# EAGLE design board (EAGLE 6.4)
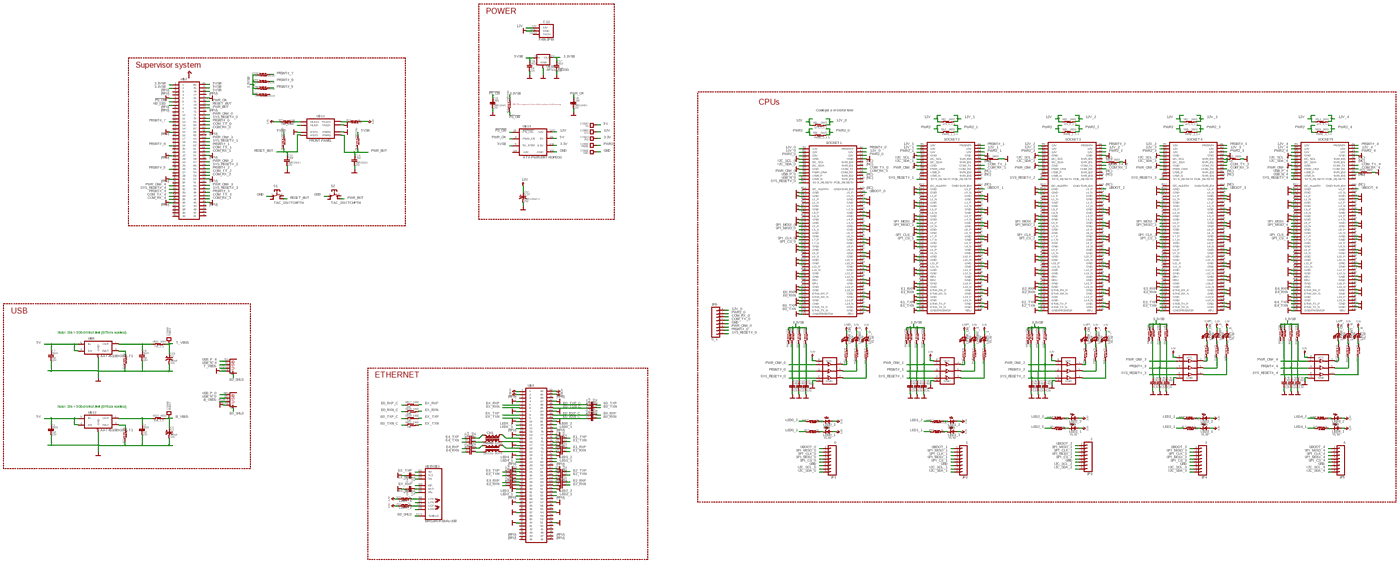
[diagram p0: schematic, sheet 1, overview]
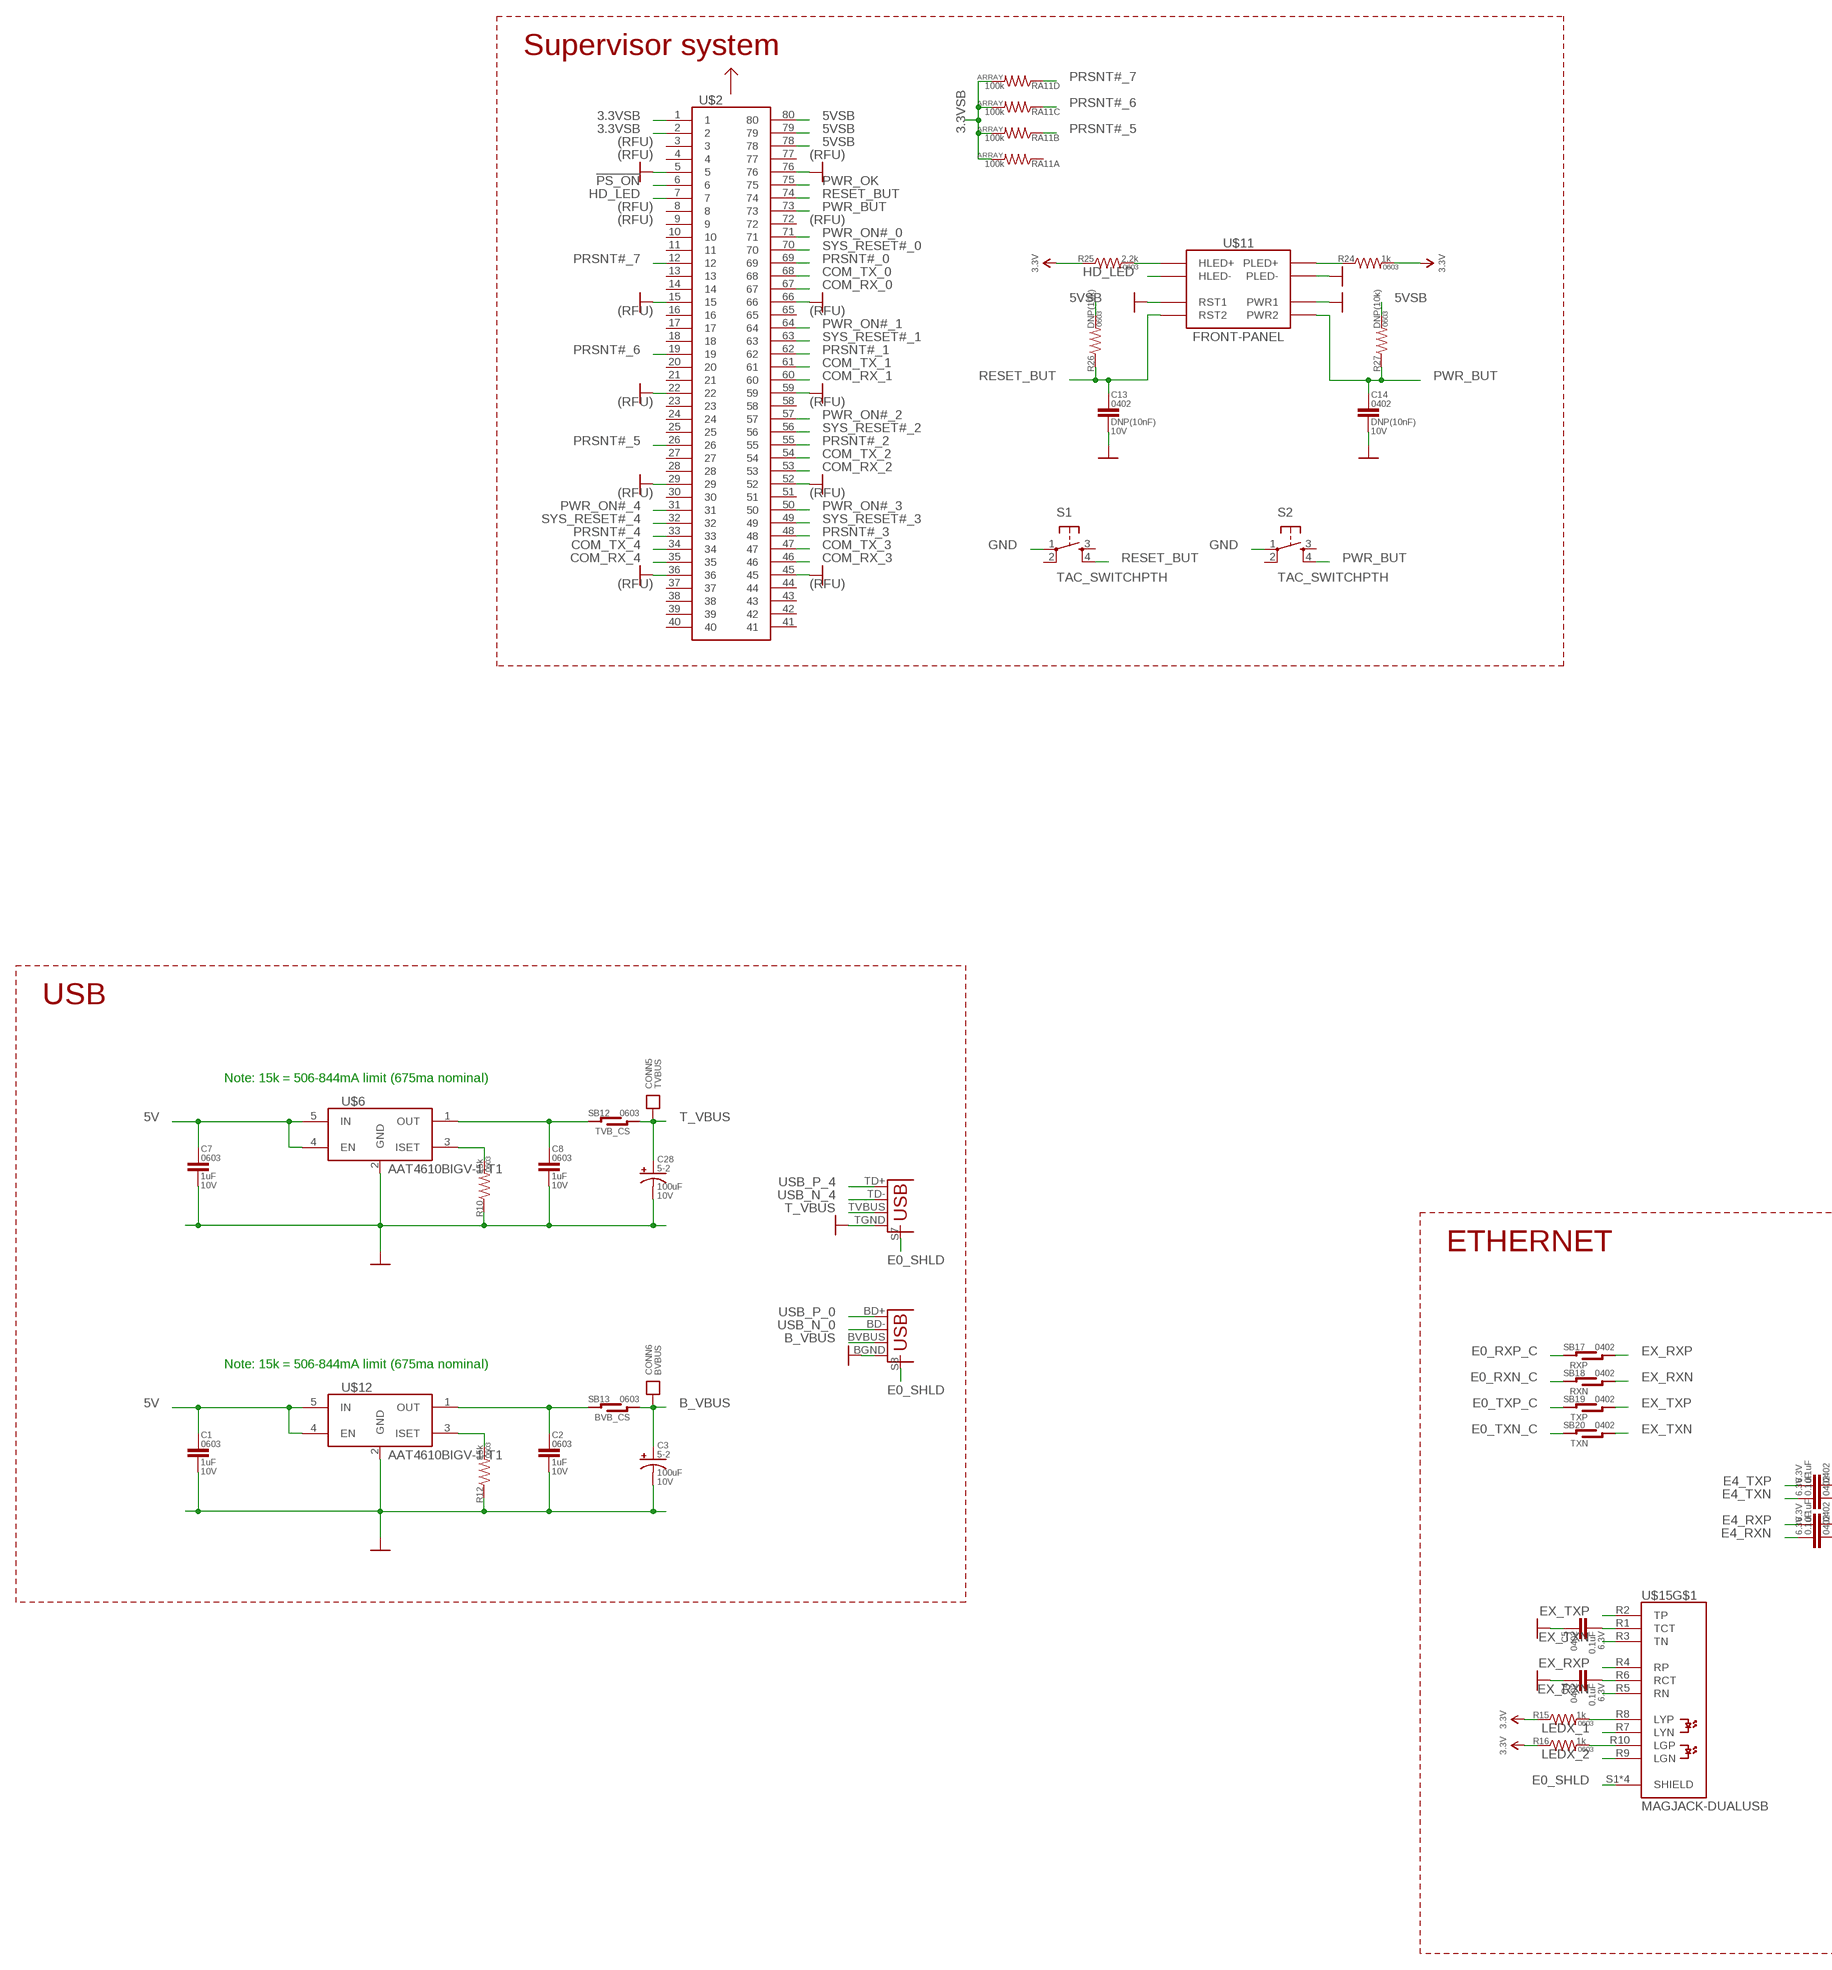
[diagram p1: schematic, sheet 1, part 1 of 4]
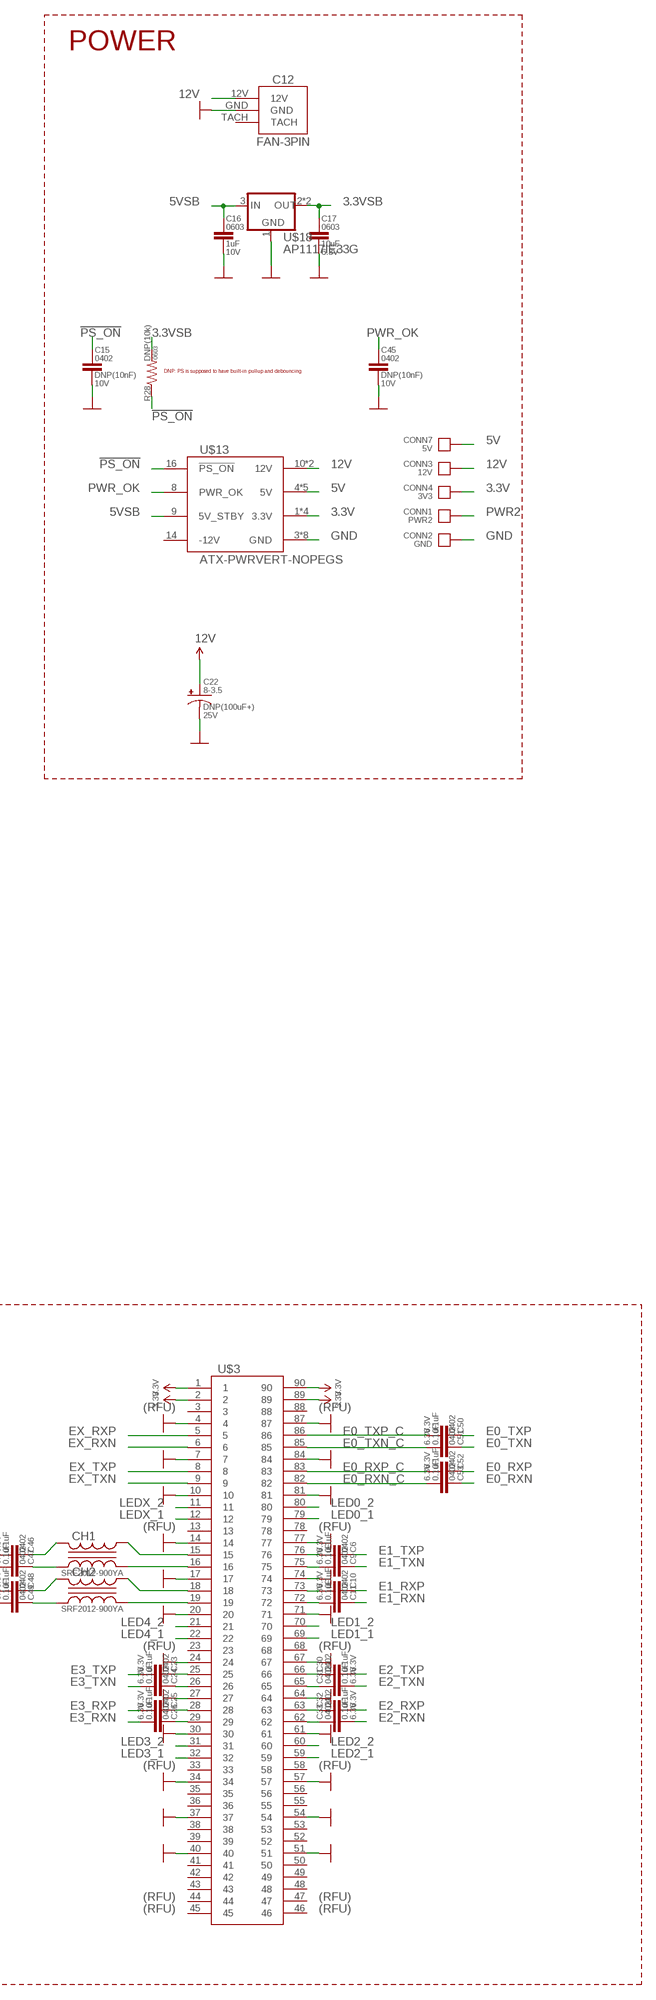
[diagram p2: schematic, sheet 1, part 2 of 4]
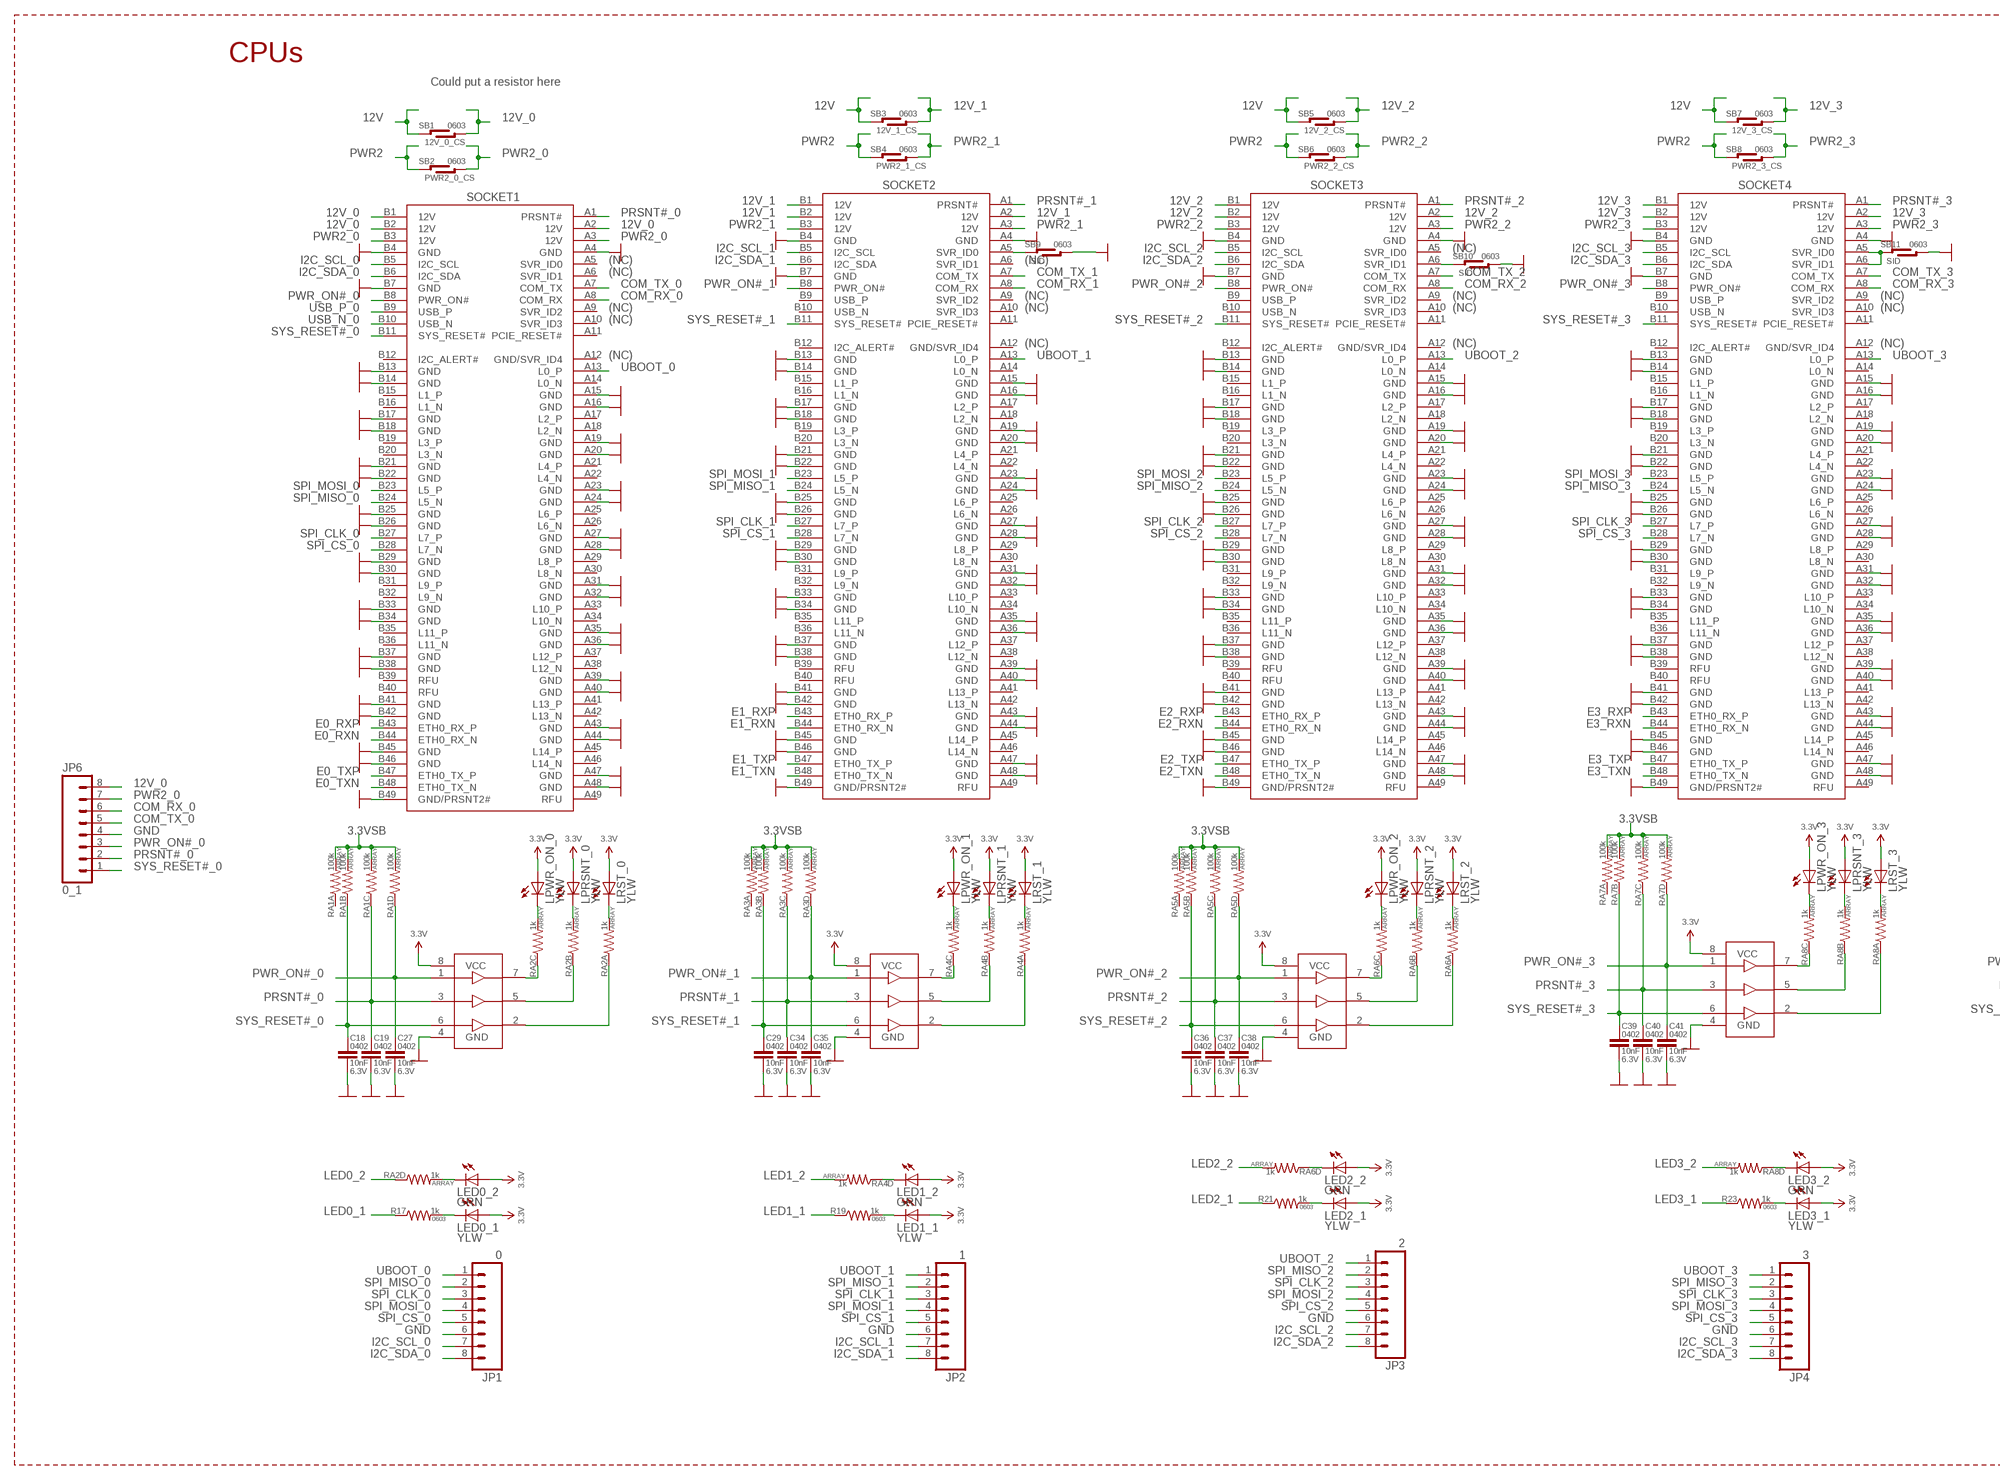
[diagram p3: schematic, sheet 1, part 3 of 4]
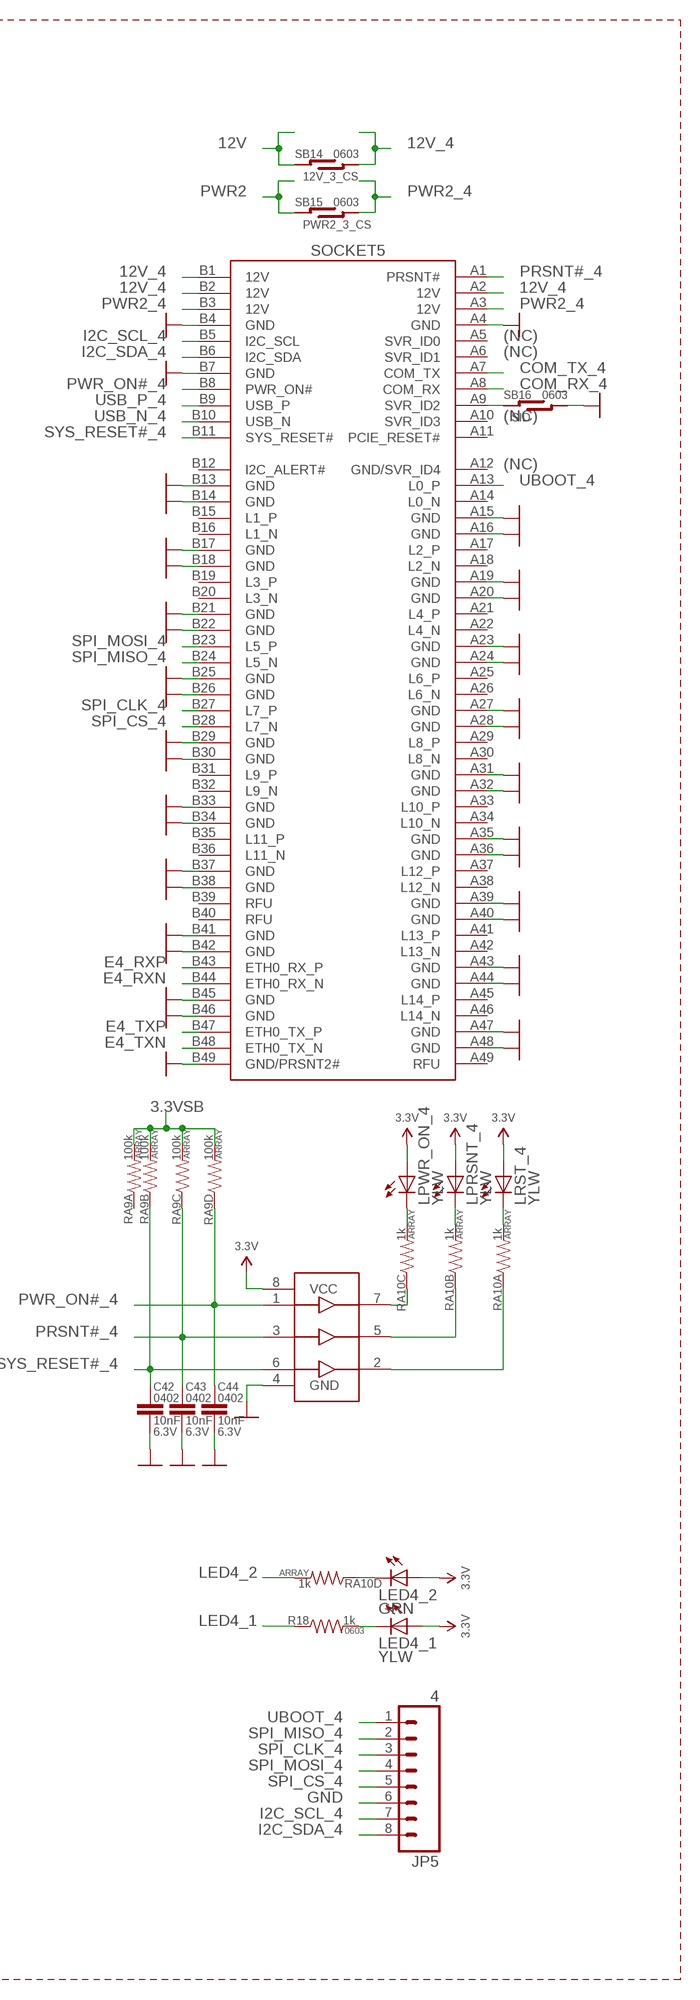
[diagram p4: schematic, sheet 1, part 4 of 4]

## Parts
C1  1uF  CAP0603  [0603-CAP]
C2  1uF  CAP0603  [0603-CAP]
C3  100uF  CAP_POLPTH-5-2  [CAP-5-2]
C4  0.1uF  CAP0402-CAP  [0402-CAP]
C5  0.1uF  CAP0402-CAP  [0402-CAP]
C6  0.1uF  CAP0402-CAP  [0402-CAP]
C7  1uF  CAP0603  [0603-CAP]
C8  1uF  CAP0603  [0603-CAP]
C9  0.1uF  CAP0402-CAP  [0402-CAP]
C10  0.1uF  CAP0402-CAP  [0402-CAP]
C11  0.1uF  CAP0402-CAP  [0402-CAP]
C12  FAN-3PIN  [FAN-3PIN]
C13  DNP(10nF)  CAP0402-CAP  [0402-CAP]
C14  DNP(10nF)  CAP0402-CAP  [0402-CAP]
C15  DNP(10nF)  CAP0402-CAP  [0402-CAP]
C16  1uF  CAP0603  [0603-CAP]
C17  10uF  CAP0603  [0603-CAP]
C18  10nF  CAP0402-CAP  [0402-CAP]
C19  10nF  CAP0402-CAP  [0402-CAP]
C22  DNP(100uF+)  CAP_POLPTH-8-3.5  [CAP-8-3.5]
C23  0.1uF  CAP0402-CAP  [0402-CAP]
C24  0.1uF  CAP0402-CAP  [0402-CAP]
C25  0.1uF  CAP0402-CAP  [0402-CAP]
C26  0.1uF  CAP0402-CAP  [0402-CAP]
C27  10nF  CAP0402-CAP  [0402-CAP]
C28  100uF  CAP_POLPTH-5-2  [CAP-5-2]
C29  10nF  CAP0402-CAP  [0402-CAP]
C30  0.1uF  CAP0402-CAP  [0402-CAP]
C31  0.1uF  CAP0402-CAP  [0402-CAP]
C32  0.1uF  CAP0402-CAP  [0402-CAP]
C33  0.1uF  CAP0402-CAP  [0402-CAP]
C34  10nF  CAP0402-CAP  [0402-CAP]
C35  10nF  CAP0402-CAP  [0402-CAP]
C36  10nF  CAP0402-CAP  [0402-CAP]
C37  10nF  CAP0402-CAP  [0402-CAP]
C38  10nF  CAP0402-CAP  [0402-CAP]
C39  10nF  CAP0402-CAP  [0402-CAP]
C40  10nF  CAP0402-CAP  [0402-CAP]
C41  10nF  CAP0402-CAP  [0402-CAP]
C42  10nF  CAP0402-CAP  [0402-CAP]
C43  10nF  CAP0402-CAP  [0402-CAP]
C44  10nF  CAP0402-CAP  [0402-CAP]
C45  DNP(10nF)  CAP0402-CAP  [0402-CAP]
C46  0.1uF  CAP0402-CAP  [0402-CAP]
C47  0.1uF  CAP0402-CAP  [0402-CAP]
C48  0.1uF  CAP0402-CAP  [0402-CAP]
C49  0.1uF  CAP0402-CAP  [0402-CAP]
C50  0.1uF  CAP0402-CAP  [0402-CAP]
C51  0.1uF  CAP0402-CAP  [0402-CAP]
C52  0.1uF  CAP0402-CAP  [0402-CAP]
C53  0.1uF  CAP0402-CAP  [0402-CAP]
CH1  SRF2012-900YA  COMMON_MODE_CHOKE  [SRF2012A]
CH2  SRF2012-900YA  COMMON_MODE_CHOKE  [SRF2012A]
CONN1  PWR2  CONNECTOR18AWG  [HOLE_18AWG]
CONN2  GND  CONNECTOR18AWG  [HOLE_18AWG]
CONN3  12V  CONNECTOR18AWG  [HOLE_18AWG]
CONN4  3V3  CONNECTOR18AWG  [HOLE_18AWG]
CONN5  TVBUS  CONNECTOR22AWG  [HOLE_22AWG]
CONN6  BVBUS  CONNECTOR22AWG  [HOLE_22AWG]
CONN7  5V  CONNECTOR18AWG  [HOLE_18AWG]
IC1  74X3G34  [TSSOP8]
IC2  74X3G34  [TSSOP8]
IC3  74X3G34  [TSSOP8]
IC4  74X3G34  [TSSOP8]
IC5  74X3G34  [TSSOP8]
JP1  0  M081X08  [1X08]
JP2  1  M081X08  [1X08]
JP3  2  M081X08  [1X08]
JP4  3  M081X08  [1X08]
JP5  4  M081X08  [1X08]
JP6  0_1  M081X08  [1X08]
LED0_1  YLW  LED0603  [0603_LED]
LED0_2  GRN  LED0603  [0603_LED]
LED1_1  YLW  LED0603  [0603_LED]
LED1_2  GRN  LED0603  [0603_LED]
LED2_1  YLW  LED0603  [0603_LED]
LED2_2  GRN  LED0603  [0603_LED]
LED3_1  YLW  LED0603  [0603_LED]
LED3_2  GRN  LED0603  [0603_LED]
LED4_1  YLW  LED0603  [0603_LED]
LED4_2  GRN  LED0603  [0603_LED]
LPRSNT_0  YLW  LED0603  [0603_LED]
LPRSNT_1  YLW  LED0603  [0603_LED]
LPRSNT_2  YLW  LED0603  [0603_LED]
LPRSNT_3  YLW  LED0603  [0603_LED]
LPRSNT_4  YLW  LED0603  [0603_LED]
LPWR_ON_0  YLW  LED0603  [0603_LED]
LPWR_ON_1  YLW  LED0603  [0603_LED]
LPWR_ON_2  YLW  LED0603  [0603_LED]
LPWR_ON_3  YLW  LED0603  [0603_LED]
LPWR_ON_4  YLW  LED0603  [0603_LED]
LRST_0  YLW  LED0603  [0603_LED]
LRST_1  YLW  LED0603  [0603_LED]
LRST_2  YLW  LED0603  [0603_LED]
LRST_3  YLW  LED0603  [0603_LED]
LRST_4  YLW  LED0603  [0603_LED]
R10  15k  RESISTOR0603  [0603-RES]
R12  15k  RESISTOR0603  [0603-RES]
R15  1k  RESISTOR0603  [0603-RES]
R16  1k  RESISTOR0603  [0603-RES]
R17  1k  RESISTOR0603  [0603-RES]
R18  1k  RESISTOR0603  [0603-RES]
R19  1k  RESISTOR0603  [0603-RES]
R21  1k  RESISTOR0603  [0603-RES]
R23  1k  RESISTOR0603  [0603-RES]
R24  1k  RESISTOR0603  [0603-RES]
R25  2.2k  RESISTOR0603  [0603-RES]
R26  DNP(10k)  RESISTOR0603  [0603-RES]
R27  DNP(10k)  RESISTOR0603  [0603-RES]
R28  DNP(10k)  RESISTOR0603  [0603-RES]
RA1  100k  RESISTOR_ARRAY0603_X4  [0603-ARV]
RA2  1k  RESISTOR_ARRAY0603_X4  [0603-ARV]
RA3  100k  RESISTOR_ARRAY0603_X4  [0603-ARV]
RA4  1k  RESISTOR_ARRAY0603_X4  [0603-ARV]
RA5  100k  RESISTOR_ARRAY0603_X4  [0603-ARV]
RA6  1k  RESISTOR_ARRAY0603_X4  [0603-ARV]
RA7  100k  RESISTOR_ARRAY0603_X4  [0603-ARV]
RA8  1k  RESISTOR_ARRAY0603_X4  [0603-ARV]
RA9  100k  RESISTOR_ARRAY0603_X4  [0603-ARV]
RA10  1k  RESISTOR_ARRAY0603_X4  [0603-ARV]
RA11  100k  RESISTOR_ARRAY0603_X4  [0603-ARV]
S1  TAC_SWITCHPTH  [TACTILE-PTH]
S2  TAC_SWITCHPTH  [TACTILE-PTH]
SB1  12V_0_CS  SOLDER-BRIDGE0603  [SB-0603]
SB2  PWR2_0_CS  SOLDER-BRIDGE0603  [SB-0603]
SB3  12V_1_CS  SOLDER-BRIDGE0603  [SB-0603]
SB4  PWR2_1_CS  SOLDER-BRIDGE0603  [SB-0603]
SB5  12V_2_CS  SOLDER-BRIDGE0603  [SB-0603]
SB6  PWR2_2_CS  SOLDER-BRIDGE0603  [SB-0603]
SB7  12V_3_CS  SOLDER-BRIDGE0603  [SB-0603]
SB8  PWR2_3_CS  SOLDER-BRIDGE0603  [SB-0603]
SB9  SID  SOLDER-BRIDGE0603  [SB-0603]
SB10  SID  SOLDER-BRIDGE0603  [SB-0603]
SB11  SID  SOLDER-BRIDGE0603  [SB-0603]
SB12  TVB_CS  SOLDER-BRIDGE0603  [SB-0603]
SB13  BVB_CS  SOLDER-BRIDGE0603  [SB-0603]
SB14  12V_3_CS  SOLDER-BRIDGE0603  [SB-0603]
SB15  PWR2_3_CS  SOLDER-BRIDGE0603  [SB-0603]
SB16  SID  SOLDER-BRIDGE0603  [SB-0603]
SB17  RXP  SOLDER-BRIDGE0402  [SB-0402]
SB18  RXN  SOLDER-BRIDGE0402  [SB-0402]
SB19  TXP  SOLDER-BRIDGE0402  [SB-0402]
SB20  TXN  SOLDER-BRIDGE0402  [SB-0402]
SOCKET1  COVEN-V1CONN  [CVN-V1-CONN]
SOCKET2  COVEN-V1CONN  [CVN-V1-CONN]
SOCKET3  COVEN-V1CONN  [CVN-V1-CONN]
SOCKET4  COVEN-V1CONN  [CVN-V1-CONN]
SOCKET5  COVEN-V1CONN  [CVN-V1-CONN]
U$2  DF40-80RCP  [DF40-RCP-80]
U$3  DF40-90RCP  [DF40-RCP-90]
U$6  AAT4610BIGV-1-T1  LOAD_SWITCH_ILIMIT  [SOT23-5]
U$11  FRONT-PANEL  [FRONT-PANEL]
U$12  AAT4610BIGV-1-T1  LOAD_SWITCH_ILIMIT  [SOT23-5]
U$13  ATX-PWRVERT-NOPEGS  [ATX-24-VERT-NOPEGS]
U$15  MAGJACK-DUALUSB  [MAGJACK-DUALUSB]
U$18  AP1117IE33G  VREGSOT223  [SOT223]

## Nets
3.3V: CONN4.P$1(P) IC1.8(VCC) IC2.8(VCC) IC3.8(VCC) IC4.8(VCC) IC5.8(VCC) LED0_1.A LED0_2.A LED1_1.A LED1_2.A LED2_1.A LED2_2.A LED3_1.A LED3_2.A LED4_1.A LED4_2.A LPRSNT_0.A LPRSNT_1.A LPRSNT_2.A LPRSNT_3.A LPRSNT_4.A LPWR_ON_0.A LPWR_ON_1.A LPWR_ON_2.A LPWR_ON_3.A LPWR_ON_4.A LRST_0.A LRST_1.A LRST_2.A LRST_3.A LRST_4.A R15.1 R16.1 R24.2 R25.1 U$3.1 U$3.2 U$3.89 U$3.90 U$13.1(3.3V) U$13.2(3.3V) U$13.12(3.3V) U$13.13(3.3V)
3.3VSB: C17.1 R28.2 RA1.5 RA1.6 RA1.7 RA1.8 RA3.5 RA3.6 RA3.7 RA3.8 RA5.5 RA5.6 RA5.7 RA5.8 RA7.5 RA7.6 RA7.7 RA7.8 RA9.5 RA9.6 RA9.7 RA9.8 RA11.5 RA11.6 RA11.7 RA11.8 U$2.1 U$2.2 U$18.2(OUT) U$18.4(OUT)
5V: C1.1 C7.1 CONN7.P$1(P) U$6.4(EN) U$6.5(IN) U$12.4(EN) U$12.5(IN) U$13.4(5V) U$13.6(5V) U$13.21(5V) U$13.22(5V) U$13.23(5V)
5VSB: C16.1 R26.2 R27.2 U$2.78 U$2.79 U$2.80 U$13.9(5V_STBY) U$18.3(IN)
12V: C12.12V C22.1(+) CONN3.P$1(P) SB1.L1 SB1.L2 SB3.L1 SB3.L2 SB5.L1 SB5.L2 SB7.L1 SB7.L2 SB14.L1 SB14.L2 U$13.10(12V) U$13.11(12V)
12V_0: JP6.8 SB1.R1 SB1.R2 SOCKET1.A2(12V) SOCKET1.B1(12V) SOCKET1.B2(12V)
12V_1: SB3.R1 SB3.R2 SOCKET2.A2(12V) SOCKET2.B1(12V) SOCKET2.B2(12V)
12V_2: SB5.R1 SB5.R2 SOCKET3.A2(12V) SOCKET3.B1(12V) SOCKET3.B2(12V)
12V_3: SB7.R1 SB7.R2 SOCKET4.A2(12V) SOCKET4.B1(12V) SOCKET4.B2(12V)
12V_4: SB14.R1 SB14.R2 SOCKET5.A2(12V) SOCKET5.B1(12V) SOCKET5.B2(12V)
!PS_ON: C15.1 R28.1 U$2.6 U$13.16(!PS_ON)
B_VBUS: C3.1(+) CONN6.P SB13.R1 SB13.R2 U$15.BVBUS(VBUS)
COM_RX_0: JP6.6 SOCKET1.A8(COM_RX) U$2.67
COM_RX_1: SOCKET2.A8(COM_RX) U$2.60
COM_RX_2: SOCKET3.A8(COM_RX) U$2.53
COM_RX_3: SOCKET4.A8(COM_RX) U$2.46
COM_RX_4: SOCKET5.A8(COM_RX) U$2.35
COM_TX_0: JP6.5 SOCKET1.A7(COM_TX) U$2.68
COM_TX_1: SOCKET2.A7(COM_TX) U$2.61
COM_TX_2: SOCKET3.A7(COM_TX) U$2.54
COM_TX_3: SOCKET4.A7(COM_TX) U$2.47
COM_TX_4: SOCKET5.A7(COM_TX) U$2.34
E0_RXN: C53.1 SOCKET1.B44(ETH0_RX_N)
E0_RXN_C: C53.2 SB18.L1 SB18.L2 U$3.82
E0_RXP: C52.1 SOCKET1.B43(ETH0_RX_P)
E0_RXP_C: C52.2 SB17.L1 SB17.L2 U$3.83
E0_SHLD: U$15.S1(SHIELD) U$15.S2(SHIELD) U$15.S3(SHIELD) U$15.S4(SHIELD) U$15.S7(SHELL) U$15.S8(SHELL)
E0_TXN: C51.1 SOCKET1.B48(ETH0_TX_N)
E0_TXN_C: C51.2 SB20.L1 SB20.L2 U$3.85
E0_TXP: C50.1 SOCKET1.B47(ETH0_TX_P)
E0_TXP_C: C50.2 SB19.L1 SB19.L2 U$3.86
E1_RXN: C11.1 SOCKET2.B44(ETH0_RX_N)
E1_RXP: C10.1 SOCKET2.B43(ETH0_RX_P)
E1_TXN: C9.1 SOCKET2.B48(ETH0_TX_N)
E1_TXP: C6.1 SOCKET2.B47(ETH0_TX_P)
E2_RXN: C33.2 SOCKET3.B44(ETH0_RX_N)
E2_RXP: C32.2 SOCKET3.B43(ETH0_RX_P)
E2_TXN: C31.2 SOCKET3.B48(ETH0_TX_N)
E2_TXP: C30.2 SOCKET3.B47(ETH0_TX_P)
E3_RXN: C26.2 SOCKET4.B44(ETH0_RX_N)
E3_RXP: C25.2 SOCKET4.B43(ETH0_RX_P)
E3_TXN: C24.2 SOCKET4.B48(ETH0_TX_N)
E3_TXP: C23.2 SOCKET4.B47(ETH0_TX_P)
E4_RXN: C49.2 SOCKET5.B44(ETH0_RX_N)
E4_RXP: C48.2 SOCKET5.B43(ETH0_RX_P)
E4_TXN: C47.2 SOCKET5.B48(ETH0_TX_N)
E4_TXP: C46.2 SOCKET5.B47(ETH0_TX_P)
EX_RXN: SB18.R1 SB18.R2 U$3.6 U$15.R5(RN)
EX_RXP: SB17.R1 SB17.R2 U$3.5 U$15.R4(RP)
EX_TXN: SB20.R1 SB20.R2 U$3.9 U$15.R3(TN)
EX_TXP: SB19.R1 SB19.R2 U$3.8 U$15.R2(TP)
GND: C1.2 C2.2 C3.2(-) C4.1 C5.1 C7.2 C8.2 C12.GND C13.2 C14.2 C15.2 C16.2 C17.2 C18.2 C19.2 C22.2(-) C27.2 C28.2(-) C29.2 C34.2 C35.2 C36.2 C37.2 C38.2 C39.2 C40.2 C41.2 C42.2 C43.2 C44.2 C45.2 CONN2.P$1(P) IC1.4(GND) IC2.4(GND) IC3.4(GND) IC4.4(GND) IC5.4(GND) JP1.6 JP2.6 JP3.6 JP4.6 JP5.6 JP6.4 R10.1 R12.1 S1.1 S2.1 SB9.R1 SB9.R2 SB10.R1 SB10.R2 SB11.R1 SB11.R2 SB16.R1 SB16.R2 SOCKET1.A4(GND) SOCKET1.A15(GND) SOCKET1.A16(GND) SOCKET1.A19(GND) SOCKET1.A20(GND) SOCKET1.A23(GND) SOCKET1.A24(GND) SOCKET1.A27(GND) SOCKET1.A28(GND) SOCKET1.A31(GND) SOCKET1.A32(GND) SOCKET1.A35(GND) SOCKET1.A36(GND) SOCKET1.A39(GND) SOCKET1.A40(GND) SOCKET1.A43(GND) SOCKET1.A44(GND) SOCKET1.A47(GND) SOCKET1.A48(GND) SOCKET1.B4(GND) SOCKET1.B7(GND) SOCKET1.B13(GND) SOCKET1.B14(GND) SOCKET1.B17(GND) SOCKET1.B18(GND) SOCKET1.B21(GND) SOCKET1.B22(GND) SOCKET1.B25(GND) SOCKET1.B26(GND) SOCKET1.B29(GND) SOCKET1.B30(GND) SOCKET1.B33(GND) SOCKET1.B34(GND) SOCKET1.B37(GND) SOCKET1.B38(GND) SOCKET1.B41(GND) SOCKET1.B42(GND) SOCKET1.B45(GND) SOCKET1.B46(GND) SOCKET1.B49(GND/PRSNT2#) SOCKET2.A4(GND) SOCKET2.A15(GND) SOCKET2.A16(GND) SOCKET2.A19(GND) SOCKET2.A20(GND) SOCKET2.A23(GND) SOCKET2.A24(GND) SOCKET2.A27(GND) SOCKET2.A28(GND) SOCKET2.A31(GND) SOCKET2.A32(GND) SOCKET2.A35(GND) SOCKET2.A36(GND) SOCKET2.A39(GND) SOCKET2.A40(GND) SOCKET2.A43(GND) SOCKET2.A44(GND) SOCKET2.A47(GND) SOCKET2.A48(GND) SOCKET2.B4(GND) SOCKET2.B7(GND) SOCKET2.B13(GND) SOCKET2.B14(GND) SOCKET2.B17(GND) SOCKET2.B18(GND) SOCKET2.B21(GND) SOCKET2.B22(GND) SOCKET2.B25(GND) SOCKET2.B26(GND) SOCKET2.B29(GND) SOCKET2.B30(GND) SOCKET2.B33(GND) SOCKET2.B34(GND) SOCKET2.B37(GND) SOCKET2.B38(GND) SOCKET2.B41(GND) SOCKET2.B42(GND) SOCKET2.B45(GND) SOCKET2.B46(GND) SOCKET2.B49(GND/PRSNT2#) SOCKET3.A4(GND) SOCKET3.A15(GND) SOCKET3.A16(GND) SOCKET3.A19(GND) SOCKET3.A20(GND) SOCKET3.A23(GND) SOCKET3.A24(GND) SOCKET3.A27(GND) SOCKET3.A28(GND) SOCKET3.A31(GND) SOCKET3.A32(GND) SOCKET3.A35(GND) SOCKET3.A36(GND) SOCKET3.A39(GND) SOCKET3.A40(GND) SOCKET3.A43(GND) SOCKET3.A44(GND) SOCKET3.A47(GND) SOCKET3.A48(GND) SOCKET3.B4(GND) SOCKET3.B7(GND) SOCKET3.B13(GND) SOCKET3.B14(GND) SOCKET3.B17(GND) SOCKET3.B18(GND) SOCKET3.B21(GND) SOCKET3.B22(GND) SOCKET3.B25(GND) SOCKET3.B26(GND) SOCKET3.B29(GND) SOCKET3.B30(GND) SOCKET3.B33(GND) SOCKET3.B34(GND) SOCKET3.B37(GND) SOCKET3.B38(GND) SOCKET3.B41(GND) SOCKET3.B42(GND) SOCKET3.B45(GND) SOCKET3.B46(GND) SOCKET3.B49(GND/PRSNT2#) SOCKET4.A4(GND) SOCKET4.A15(GND) SOCKET4.A16(GND) SOCKET4.A19(GND) SOCKET4.A20(GND) SOCKET4.A23(GND) SOCKET4.A24(GND) SOCKET4.A27(GND) SOCKET4.A28(GND) SOCKET4.A31(GND) SOCKET4.A32(GND) SOCKET4.A35(GND) SOCKET4.A36(GND) SOCKET4.A39(GND) SOCKET4.A40(GND) SOCKET4.A43(GND) SOCKET4.A44(GND) SOCKET4.A47(GND) SOCKET4.A48(GND) SOCKET4.B4(GND) SOCKET4.B7(GND) SOCKET4.B13(GND) SOCKET4.B14(GND) SOCKET4.B17(GND) SOCKET4.B18(GND) SOCKET4.B21(GND) SOCKET4.B22(GND) SOCKET4.B25(GND) SOCKET4.B26(GND) SOCKET4.B29(GND) SOCKET4.B30(GND) SOCKET4.B33(GND) SOCKET4.B34(GND) SOCKET4.B37(GND) SOCKET4.B38(GND) SOCKET4.B41(GND) SOCKET4.B42(GND) SOCKET4.B45(GND) SOCKET4.B46(GND) SOCKET4.B49(GND/PRSNT2#) SOCKET5.A4(GND) SOCKET5.A15(GND) SOCKET5.A16(GND) SOCKET5.A19(GND) SOCKET5.A20(GND) SOCKET5.A23(GND) SOCKET5.A24(GND) SOCKET5.A27(GND) SOCKET5.A28(GND) SOCKET5.A31(GND) SOCKET5.A32(GND) SOCKET5.A35(GND) SOCKET5.A36(GND) SOCKET5.A39(GND) SOCKET5.A40(GND) SOCKET5.A43(GND) SOCKET5.A44(GND) SOCKET5.A47(GND) SOCKET5.A48(GND) SOCKET5.B4(GND) SOCKET5.B7(GND) SOCKET5.B13(GND) SOCKET5.B14(GND) SOCKET5.B17(GND) SOCKET5.B18(GND) SOCKET5.B21(GND) SOCKET5.B22(GND) SOCKET5.B25(GND) SOCKET5.B26(GND) SOCKET5.B29(GND) SOCKET5.B30(GND) SOCKET5.B33(GND) SOCKET5.B34(GND) SOCKET5.B37(GND) SOCKET5.B38(GND) SOCKET5.B41(GND) SOCKET5.B42(GND) SOCKET5.B45(GND) SOCKET5.B46(GND) SOCKET5.B49(GND/PRSNT2#) U$2.5 U$2.15 U$2.22 U$2.29 U$2.36 U$2.45 U$2.52 U$2.59 U$2.66 U$2.76 U$3.4 U$3.7 U$3.10 U$3.14 U$3.17 U$3.20 U$3.24 U$3.27 U$3.30 U$3.34 U$3.37 U$3.40 U$3.51 U$3.54 U$3.57 U$3.61 U$3.64 U$3.67 U$3.71 U$3.74 U$3.77 U$3.81 U$3.84 U$3.87 U$6.2(GND) U$11.PLED- U$11.PWR_1(PWR1) U$11.RST_1(RST1) U$12.2(GND) U$13.3(GND) U$13.5(GND) U$13.7(GND) U$13.15(GND) U$13.17(GND) U$13.18(GND) U$13.19(GND) U$13.24(GND) U$15.BGND(GND) U$15.TGND(GND) U$18.1(GND)
HD_LED: U$2.7 U$11.HDLED-(HLED-)
HOST_VBUS_U: C8.1 SB12.L1 SB12.L2 U$6.1(OUT)
HOST_VBUS_U1: C2.1 SB13.L1 SB13.L2 U$12.1(OUT)
I2C_SCL_0: JP1.7 SOCKET1.B5(I2C_SCL)
I2C_SCL_1: JP2.7 SOCKET2.B5(I2C_SCL)
I2C_SCL_2: JP3.7 SOCKET3.B5(I2C_SCL)
I2C_SCL_3: JP4.7 SOCKET4.B5(I2C_SCL)
I2C_SCL_4: JP5.7 SOCKET5.B5(I2C_SCL)
I2C_SDA_0: JP1.8 SOCKET1.B6(I2C_SDA)
I2C_SDA_1: JP2.8 SOCKET2.B6(I2C_SDA)
I2C_SDA_2: JP3.8 SOCKET3.B6(I2C_SDA)
I2C_SDA_3: JP4.8 SOCKET4.B6(I2C_SDA)
I2C_SDA_4: JP5.8 SOCKET5.B6(I2C_SDA)
LED0_1: R17.1 U$3.79
LED0_2: RA2.4 U$3.80
LED1_1: R19.1 U$3.69
LED1_2: RA4.5 U$3.70
LED2_1: R21.1 U$3.59
LED2_2: RA6.5 U$3.60
LED3_1: R23.1 U$3.32
LED3_2: RA8.5 U$3.31
LED4_1: R18.1 U$3.22
LED4_2: RA10.5 U$3.21
LEDX_1: U$3.12 U$15.R7(LYN)
LEDX_2: U$3.11 U$15.R9(LGN)
N$1: SB9.L1 SB9.L2 SOCKET2.A5(SVR_ID0)
N$2: SB11.L1 SB11.L2 SOCKET4.A5(SVR_ID0) SOCKET4.A6(SVR_ID1)
N$3: SB10.L1 SB10.L2 SOCKET3.A6(SVR_ID1)
N$4: IC2.7(1Y) RA4.3
N$5: IC2.5(2Y) RA4.2
N$6: LPWR_ON_1.C RA4.6
N$7: LPWR_ON_0.C RA2.6
N$8: LPRSNT_0.C RA2.7
N$9: IC1.7(1Y) RA2.3
N$10: IC1.5(2Y) RA2.2
N$11: IC1.2(3Y) RA2.1
N$12: LRST_0.C RA2.8
N$13: LPRSNT_1.C RA4.7
N$14: IC2.2(3Y) RA4.1
N$15: LRST_1.C RA4.8
N$16: IC3.7(1Y) RA6.3
N$17: IC3.5(2Y) RA6.2
N$18: LPWR_ON_2.C RA6.6
N$19: LPRSNT_2.C RA6.7
N$20: IC3.2(3Y) RA6.1
N$21: LRST_2.C RA6.8
N$22: IC4.7(1Y) RA8.3
N$23: IC4.5(2Y) RA8.2
N$24: LPWR_ON_3.C RA8.6
N$25: LPRSNT_3.C RA8.7
N$26: IC4.2(3Y) RA8.1
N$27: LRST_3.C RA8.8
N$28: LED4_1.C R18.2
N$29: C11.2 U$3.72
N$30: R10.2 U$6.3(ISET)
N$31: R12.2 U$12.3(ISET)
N$32: C5.2 U$15.R1(TCT)
N$33: C4.2 U$15.R6(RCT)
N$34: R25.2 U$11.HDLED+(HLED+)
N$35: R15.2 U$15.R8(LYP)
N$36: SB16.L1 SB16.L2 SOCKET5.A9(SVR_ID2)
N$37: IC5.7(1Y) RA10.3
N$38: IC5.5(2Y) RA10.2
N$40: R16.2 U$15.R10(LGP)
N$41: C6.2 U$3.76
N$42: R24.1 U$11.PLED+
N$43: CH2.3 U$3.19
N$44: C9.2 U$3.75
N$45: CH2.2 U$3.18
N$46: CH1.3 U$3.16
N$47: LPWR_ON_4.C RA10.6
N$48: LPRSNT_4.C RA10.7
N$49: C33.1 U$3.62
N$50: C32.1 U$3.63
N$51: C31.1 U$3.65
N$52: C30.1 U$3.66
N$53: C25.1 U$3.28
N$54: C24.1 U$3.26
N$55: C23.1 U$3.25
N$56: LED0_1.C R17.2
N$57: LED0_2.C RA2.5
N$58: LED1_2.C RA4.4
N$59: LED1_1.C R19.2
N$60: LED2_2.C RA6.4
N$61: LED2_1.C R21.2
N$62: LED3_2.C RA8.4
N$63: LED3_1.C R23.2
N$64: IC5.2(3Y) RA10.1
N$65: LRST_4.C RA10.8
N$66: LED4_2.C RA10.4
N$67: CH1.2 U$3.15
N$68: C46.1 CH1.1
N$69: C47.1 CH1.4
N$70: C48.1 CH2.1
N$71: C49.1 CH2.4
N$73: C10.2 U$3.73
N$96: C26.1 U$3.29
PRSNT#_0: C19.1 IC1.3(2A) JP6.2 RA1.3 SOCKET1.A1(PRSNT#) U$2.69
PRSNT#_1: C34.1 IC2.3(2A) RA3.3 SOCKET2.A1(PRSNT#) U$2.62
PRSNT#_2: C37.1 IC3.3(2A) RA5.3 SOCKET3.A1(PRSNT#) U$2.55
PRSNT#_3: C40.1 IC4.3(2A) RA7.3 SOCKET4.A1(PRSNT#) U$2.48
PRSNT#_4: C43.1 IC5.3(2A) RA9.3 SOCKET5.A1(PRSNT#) U$2.33
PRSNT#_5: RA11.2 U$2.26
PRSNT#_6: RA11.3 U$2.19
PRSNT#_7: RA11.4 U$2.12
PWR2: CONN1.P$1(P) SB2.L1 SB2.L2 SB4.L1 SB4.L2 SB6.L1 SB6.L2 SB8.L1 SB8.L2 SB15.L1 SB15.L2
PWR2_0: JP6.7 SB2.R1 SB2.R2 SOCKET1.A3(12V) SOCKET1.B3(12V)
PWR2_1: SB4.R1 SB4.R2 SOCKET2.A3(12V) SOCKET2.B3(12V)
PWR2_2: SB6.R1 SB6.R2 SOCKET3.A3(12V) SOCKET3.B3(12V)
PWR2_3: SB8.R1 SB8.R2 SOCKET4.A3(12V) SOCKET4.B3(12V)
PWR2_4: SB15.R1 SB15.R2 SOCKET5.A3(12V) SOCKET5.B3(12V)
PWR_BUT: C14.1 R27.1 S2.4 U$2.73 U$11.PWR_2(PWR2)
PWR_OK: C45.1 U$2.75 U$13.8(PWR_OK)
PWR_ON#_0: C27.1 IC1.1(1A) JP6.3 RA1.4 SOCKET1.B8(PWR_ON#) U$2.71
PWR_ON#_1: C35.1 IC2.1(1A) RA3.4 SOCKET2.B8(PWR_ON#) U$2.64
PWR_ON#_2: C38.1 IC3.1(1A) RA5.4 SOCKET3.B8(PWR_ON#) U$2.57
PWR_ON#_3: C41.1 IC4.1(1A) RA7.4 SOCKET4.B8(PWR_ON#) U$2.50
PWR_ON#_4: C44.1 IC5.1(1A) RA9.4 SOCKET5.B8(PWR_ON#) U$2.31
RESET_BUT: C13.1 R26.1 S1.4 U$2.74 U$11.RST_2(RST2)
SPI_CLK_0: JP1.3 SOCKET1.B27(L7_P)
SPI_CLK_1: JP2.3 SOCKET2.B27(L7_P)
SPI_CLK_2: JP3.3 SOCKET3.B27(L7_P)
SPI_CLK_3: JP4.3 SOCKET4.B27(L7_P)
SPI_CLK_4: JP5.3 SOCKET5.B27(L7_P)
SPI_CS_0: JP1.5 SOCKET1.B28(L7_N)
SPI_CS_1: JP2.5 SOCKET2.B28(L7_N)
SPI_CS_2: JP3.5 SOCKET3.B28(L7_N)
SPI_CS_3: JP4.5 SOCKET4.B28(L7_N)
SPI_CS_4: JP5.5 SOCKET5.B28(L7_N)
SPI_MISO_0: JP1.2 SOCKET1.B24(L5_N)
SPI_MISO_1: JP2.2 SOCKET2.B24(L5_N)
SPI_MISO_2: JP3.2 SOCKET3.B24(L5_N)
SPI_MISO_3: JP4.2 SOCKET4.B24(L5_N)
SPI_MISO_4: JP5.2 SOCKET5.B24(L5_N)
SPI_MOSI_0: JP1.4 SOCKET1.B23(L5_P)
SPI_MOSI_1: JP2.4 SOCKET2.B23(L5_P)
SPI_MOSI_2: JP3.4 SOCKET3.B23(L5_P)
SPI_MOSI_3: JP4.4 SOCKET4.B23(L5_P)
SPI_MOSI_4: JP5.4 SOCKET5.B23(L5_P)
SYS_RESET#_0: C18.1 IC1.6(3A) JP6.1 RA1.2 SOCKET1.B11(SYS_RESET#) U$2.70
SYS_RESET#_1: C29.1 IC2.6(3A) RA3.2 SOCKET2.B11(SYS_RESET#) U$2.63
SYS_RESET#_2: C36.1 IC3.6(3A) RA5.2 SOCKET3.B11(SYS_RESET#) U$2.56
SYS_RESET#_3: C39.1 IC4.6(3A) RA7.2 SOCKET4.B11(SYS_RESET#) U$2.49
SYS_RESET#_4: C42.1 IC5.6(3A) RA9.2 SOCKET5.B11(SYS_RESET#) U$2.32
T_VBUS: C28.1(+) CONN5.P SB12.R1 SB12.R2 U$15.TVBUS(VBUS)
UBOOT_0: JP1.1 SOCKET1.A13(L0_P)
UBOOT_1: JP2.1 SOCKET2.A13(L0_P)
UBOOT_2: JP3.1 SOCKET3.A13(L0_P)
UBOOT_3: JP4.1 SOCKET4.A13(L0_P)
UBOOT_4: JP5.1 SOCKET5.A13(L0_P)
USB_N_0: SOCKET1.B10(USB_N) U$15.BD-(D-)
USB_N_4: SOCKET5.B10(USB_N) U$15.TD-(D-)
USB_P_0: SOCKET1.B9(USB_P) U$15.BD+(D+)
USB_P_4: SOCKET5.B9(USB_P) U$15.TD+(D+)
Unconnected: C12.TACH RA1.1 RA3.1 RA5.1 RA7.1 RA9.1 RA11.1 S1.2 S1.3 S2.2 S2.3 SOCKET1.A5(SVR_ID0) SOCKET1.A6(SVR_ID1) SOCKET1.A9(SVR_ID2) SOCKET1.A10(SVR_ID3) SOCKET1.A11(PCIE_RESET#) SOCKET1.A12(GND/SVR_ID4) SOCKET1.A14(L0_N) SOCKET1.A17(L2_P) SOCKET1.A18(L2_N) SOCKET1.A21(L4_P) SOCKET1.A22(L4_N) SOCKET1.A25(L6_P) SOCKET1.A26(L6_N) SOCKET1.A29(L8_P) SOCKET1.A30(L8_N) SOCKET1.A33(L10_P) SOCKET1.A34(L10_N) SOCKET1.A37(L12_P) SOCKET1.A38(L12_N) SOCKET1.A41(L13_P) SOCKET1.A42(L13_N) SOCKET1.A45(L14_P) SOCKET1.A46(L14_N) SOCKET1.A49(RFU) SOCKET1.B12(I2C_ALERT#) SOCKET1.B15(L1_P) SOCKET1.B16(L1_N) SOCKET1.B19(L3_P) SOCKET1.B20(L3_N) SOCKET1.B31(L9_P) SOCKET1.B32(L9_N) SOCKET1.B35(L11_P) SOCKET1.B36(L11_N) SOCKET1.B39(RFU) SOCKET1.B40(RFU) SOCKET2.A6(SVR_ID1) SOCKET2.A9(SVR_ID2) SOCKET2.A10(SVR_ID3) SOCKET2.A11(PCIE_RESET#) SOCKET2.A12(GND/SVR_ID4) SOCKET2.A14(L0_N) SOCKET2.A17(L2_P) SOCKET2.A18(L2_N) SOCKET2.A21(L4_P) SOCKET2.A22(L4_N) SOCKET2.A25(L6_P) SOCKET2.A26(L6_N) SOCKET2.A29(L8_P) SOCKET2.A30(L8_N) SOCKET2.A33(L10_P) SOCKET2.A34(L10_N) SOCKET2.A37(L12_P) SOCKET2.A38(L12_N) SOCKET2.A41(L13_P) SOCKET2.A42(L13_N) SOCKET2.A45(L14_P) SOCKET2.A46(L14_N) SOCKET2.A49(RFU) SOCKET2.B9(USB_P) SOCKET2.B10(USB_N) SOCKET2.B12(I2C_ALERT#) SOCKET2.B15(L1_P) SOCKET2.B16(L1_N) SOCKET2.B19(L3_P) SOCKET2.B20(L3_N) SOCKET2.B31(L9_P) SOCKET2.B32(L9_N) SOCKET2.B35(L11_P) SOCKET2.B36(L11_N) SOCKET2.B39(RFU) SOCKET2.B40(RFU) SOCKET3.A5(SVR_ID0) SOCKET3.A9(SVR_ID2) SOCKET3.A10(SVR_ID3) SOCKET3.A11(PCIE_RESET#) SOCKET3.A12(GND/SVR_ID4) SOCKET3.A14(L0_N) SOCKET3.A17(L2_P) SOCKET3.A18(L2_N) SOCKET3.A21(L4_P) SOCKET3.A22(L4_N) SOCKET3.A25(L6_P) SOCKET3.A26(L6_N) SOCKET3.A29(L8_P) SOCKET3.A30(L8_N) SOCKET3.A33(L10_P) SOCKET3.A34(L10_N) SOCKET3.A37(L12_P) SOCKET3.A38(L12_N) SOCKET3.A41(L13_P) SOCKET3.A42(L13_N) SOCKET3.A45(L14_P) SOCKET3.A46(L14_N) SOCKET3.A49(RFU) SOCKET3.B9(USB_P) SOCKET3.B10(USB_N) SOCKET3.B12(I2C_ALERT#) SOCKET3.B15(L1_P) SOCKET3.B16(L1_N) SOCKET3.B19(L3_P) SOCKET3.B20(L3_N) SOCKET3.B31(L9_P) SOCKET3.B32(L9_N) SOCKET3.B35(L11_P) SOCKET3.B36(L11_N) SOCKET3.B39(RFU) SOCKET3.B40(RFU) SOCKET4.A9(SVR_ID2) SOCKET4.A10(SVR_ID3) SOCKET4.A11(PCIE_RESET#) SOCKET4.A12(GND/SVR_ID4) SOCKET4.A14(L0_N) SOCKET4.A17(L2_P) SOCKET4.A18(L2_N) SOCKET4.A21(L4_P) SOCKET4.A22(L4_N) SOCKET4.A25(L6_P) SOCKET4.A26(L6_N) SOCKET4.A29(L8_P) SOCKET4.A30(L8_N) SOCKET4.A33(L10_P) SOCKET4.A34(L10_N) SOCKET4.A37(L12_P) SOCKET4.A38(L12_N) SOCKET4.A41(L13_P) SOCKET4.A42(L13_N) SOCKET4.A45(L14_P) SOCKET4.A46(L14_N) SOCKET4.A49(RFU) SOCKET4.B9(USB_P) SOCKET4.B10(USB_N) SOCKET4.B12(I2C_ALERT#) SOCKET4.B15(L1_P) SOCKET4.B16(L1_N) SOCKET4.B19(L3_P) SOCKET4.B20(L3_N) SOCKET4.B31(L9_P) SOCKET4.B32(L9_N) SOCKET4.B35(L11_P) SOCKET4.B36(L11_N) SOCKET4.B39(RFU) SOCKET4.B40(RFU) SOCKET5.A5(SVR_ID0) SOCKET5.A6(SVR_ID1) SOCKET5.A10(SVR_ID3) SOCKET5.A11(PCIE_RESET#) SOCKET5.A12(GND/SVR_ID4) SOCKET5.A14(L0_N) SOCKET5.A17(L2_P) SOCKET5.A18(L2_N) SOCKET5.A21(L4_P) SOCKET5.A22(L4_N) SOCKET5.A25(L6_P) SOCKET5.A26(L6_N) SOCKET5.A29(L8_P) SOCKET5.A30(L8_N) SOCKET5.A33(L10_P) SOCKET5.A34(L10_N) SOCKET5.A37(L12_P) SOCKET5.A38(L12_N) SOCKET5.A41(L13_P) SOCKET5.A42(L13_N) SOCKET5.A45(L14_P) SOCKET5.A46(L14_N) SOCKET5.A49(RFU) SOCKET5.B12(I2C_ALERT#) SOCKET5.B15(L1_P) SOCKET5.B16(L1_N) SOCKET5.B19(L3_P) SOCKET5.B20(L3_N) SOCKET5.B31(L9_P) SOCKET5.B32(L9_N) SOCKET5.B35(L11_P) SOCKET5.B36(L11_N) SOCKET5.B39(RFU) SOCKET5.B40(RFU) U$2.3 U$2.4 U$2.8 U$2.9 U$2.10 U$2.11 U$2.13 U$2.14 U$2.16 U$2.17 U$2.18 U$2.20 U$2.21 U$2.23 U$2.24 U$2.25 U$2.27 U$2.28 U$2.30 U$2.37 U$2.38 U$2.39 U$2.40 U$2.41 U$2.42 U$2.43 U$2.44 U$2.51 U$2.58 U$2.65 U$2.72 U$2.77 U$3.3 U$3.13 U$3.23 U$3.33 U$3.35 U$3.36 U$3.38 U$3.39 U$3.41 U$3.42 U$3.43 U$3.44 U$3.45 U$3.46 U$3.47 U$3.48 U$3.49 U$3.50 U$3.52 U$3.53 U$3.55 U$3.56 U$3.58 U$3.68 U$3.78 U$3.88 U$13.14(-12V)

## Notes on the sheet
- POWER
- Supervisor system
- (RFU)
- (RFU) | (RFU)
- DNP: PS is supposed to have built-in pullup and debouncing | CPUs
- (RFU)
- (RFU) | (RFU) | Could put a resistor here
- (RFU) | (RFU)
- (RFU) | (RFU) | (NC) | (NC)
- (NC) | (NC) | (NC)
- (NC)
- (NC) | (NC) | (NC)
- (NC) | (NC) | (NC) | (NC) | (NC)
- (NC)
- (RFU) | (RFU)
- (NC) | (NC) | (NC) | (NC)
- (NC)
- (RFU) | (RFU)
- USB
- Note: 15k = 506-844mA limit (675ma nominal)
- ETHERNET
- (RFU) | (RFU)
- Note: 15k = 506-844mA limit (675ma nominal)
- (RFU) | (RFU)
- (RFU) | (RFU)
- (RFU) | (RFU)
- (RFU) | (RFU)
- (RFU) | (RFU)

## Library data of the parts
C1 C2 C7 C8 C16 = kmod-passives:CAP: Capacitor Standard 0603 ceramic capacitor, and 0.1" leaded capacitor.; PACKAGE: 0603; VOLTAGE: 10V
C3 C28 = kmod-passives:CAP_POL: Capacitor Polarized These are standard SMD and PTH capacitors. Normally 10uF, 47uF, and 100uF in electrolytic and tantalum varieties. Always verify the external diameter of the through hole cap, it varies with capacity, voltage, and manufacturer. The EIA devices should be standard.; PACKAGE: 5-2; VOLTAGE: 10V
C4-C6 C9-C11 C18 C19 C23-C27 C29-C44 C46-C53 = kmod-passives:CAP: Capacitor Standard 0603 ceramic capacitor, and 0.1" leaded capacitor.; PACKAGE: 0402; VOLTAGE: 6.3V
C12 = kmod-connectors:FAN-3PIN
C13-C15 C45 = kmod-passives:CAP: Capacitor Standard 0603 ceramic capacitor, and 0.1" leaded capacitor.; PACKAGE: 0402; VOLTAGE: 10V
C17 = kmod-passives:CAP: Capacitor Standard 0603 ceramic capacitor, and 0.1" leaded capacitor.; PACKAGE: 0603; VOLTAGE: 6.3V
C22 = kmod-passives:CAP_POL: Capacitor Polarized These are standard SMD and PTH capacitors. Normally 10uF, 47uF, and 100uF in electrolytic and tantalum varieties. Always verify the external diameter of the through hole cap, it varies with capacity, voltage, and manufacturer. The EIA devices should be standard.; PACKAGE: 8-3.5; VOLTAGE: 25V
CH1 CH2 = kmod-passives:COMMON_MODE_CHOKE
CONN1-CONN7 = kmod-nonparts:CONNECTOR: Collection of holes/pads for testing/connecting
IC1-IC5 = kmod-testing:74X3G34: Triple buffer
JP1-JP6 = SparkFun-Connectors:M08: Header 8 Standard 8-pin 0.1" header. Use with straight break away headers (SKU : PRT-00116), right angle break away headers (PRT-00553), swiss pins (PRT-00743), machine pins (PRT-00117), and female headers (PRT-00115).
LED0_1 LED0_2 LED1_1 LED1_2 LED2_1 LED2_2 LED3_1 LED3_2 LED4_1 LED4_2 LPRSNT_0 LPRSNT_1-LPRSNT_4 LPWR_ON_0 LPWR_ON_1-LPWR_ON_4 LRST_0 LRST_1-LRST_4 = kmod-passives:LED
R10 R12 R15-R19 R21 R23-R28 = kmod-passives:RESISTOR: Resistor Basic schematic elements and footprints for 0603, 1206, and PTH resistors.; PACKAGE: 0603
RA1-RA11 = kmod-passives:RESISTOR_ARRAY; PACKAGE: ARRAY
S1 S2 = kmod-mechanical:TAC_SWITCH: Momentary Switch Button commonly used for reset or general input. Spark Fun Electronics SKU : COM-00097 SMT- SWCH-08247
SB1-SB16 = kmod-nonparts:SOLDER-BRIDGE; PACKAGE: 0603
SB17-SB20 = kmod-nonparts:SOLDER-BRIDGE; PACKAGE: 0402
SOCKET1-SOCKET5 = kmod-connectors:COVEN-V1
U$2 = kmod-connectors:DF40-80
U$3 = kmod-connectors:DF40-90
U$6 U$12 = kmod-ics:LOAD_SWITCH_ILIMIT: Current-limited high-side load switch Such as for USB vbus. Note: active-high enable.
U$11 = kmod-connectors:FRONT-PANEL
U$13 = kmod-connectors:ATX-PWR
U$15 = kmod-connectors:MAGJACK-DUALUSB
U$18 = kmod-ics:VREG

## Board
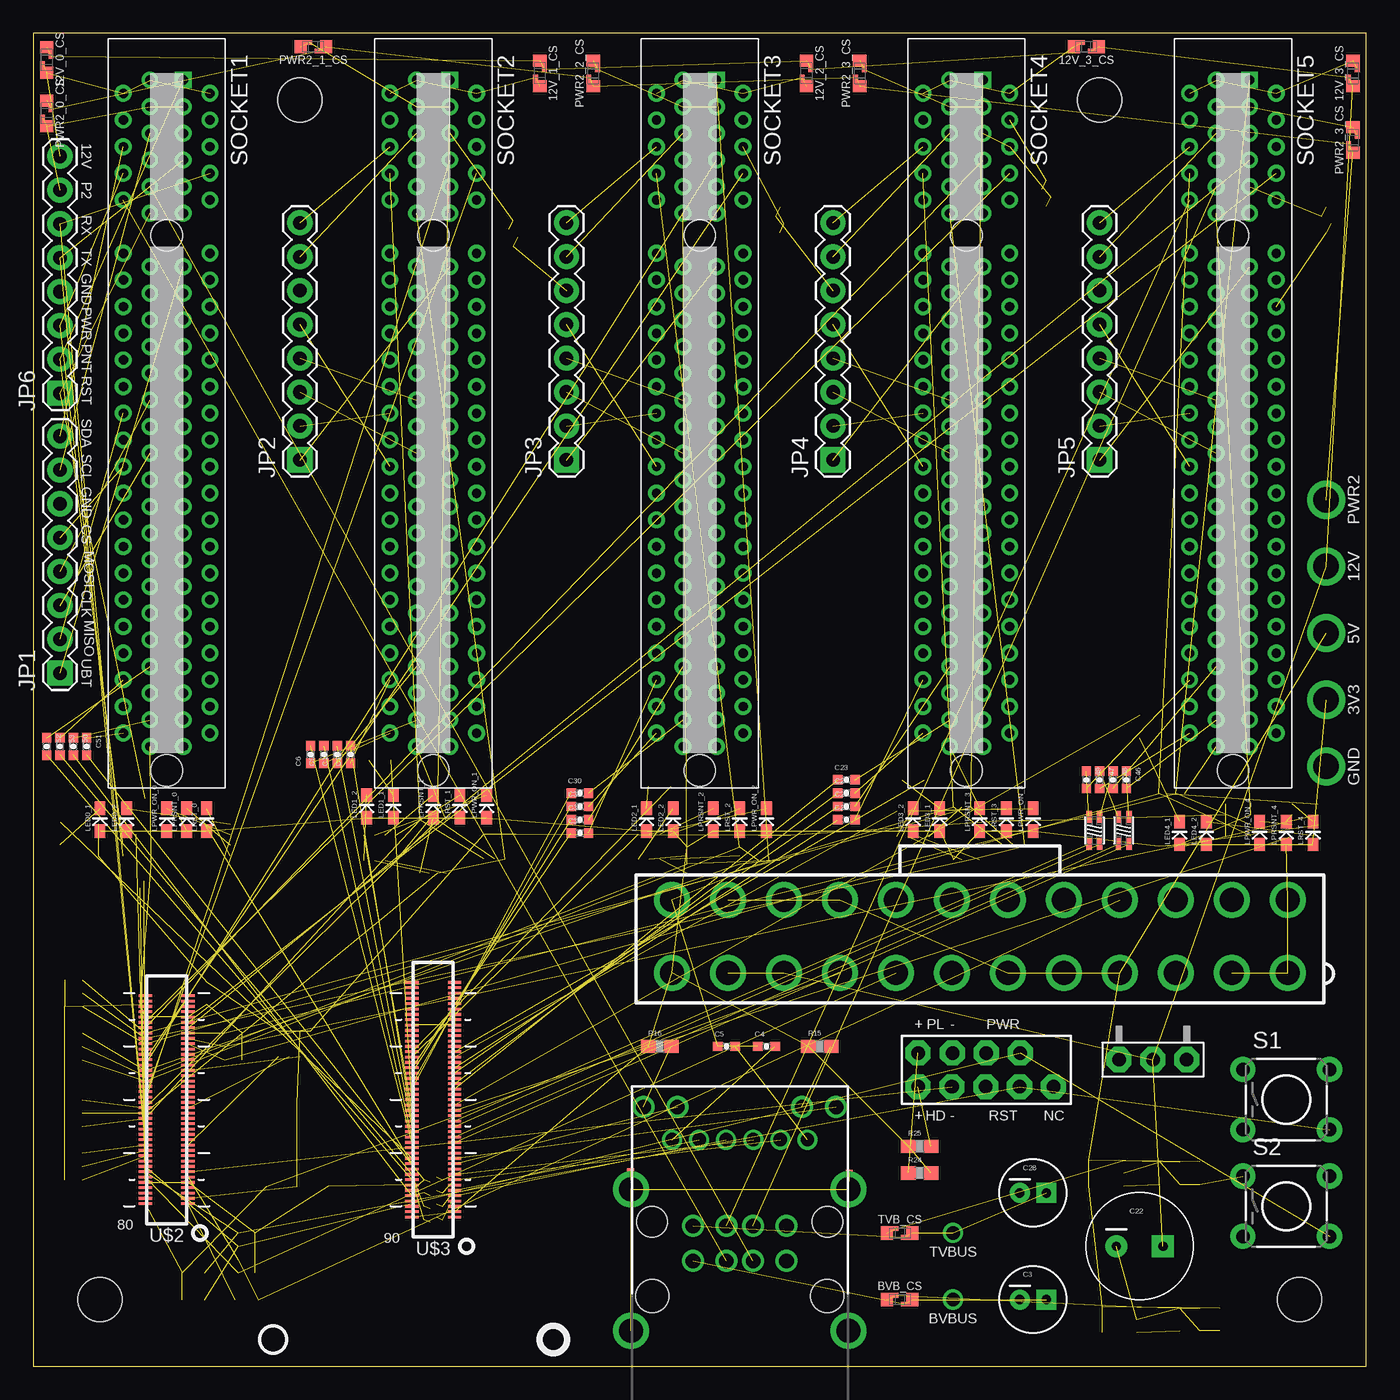
[diagram p5: board, top side]
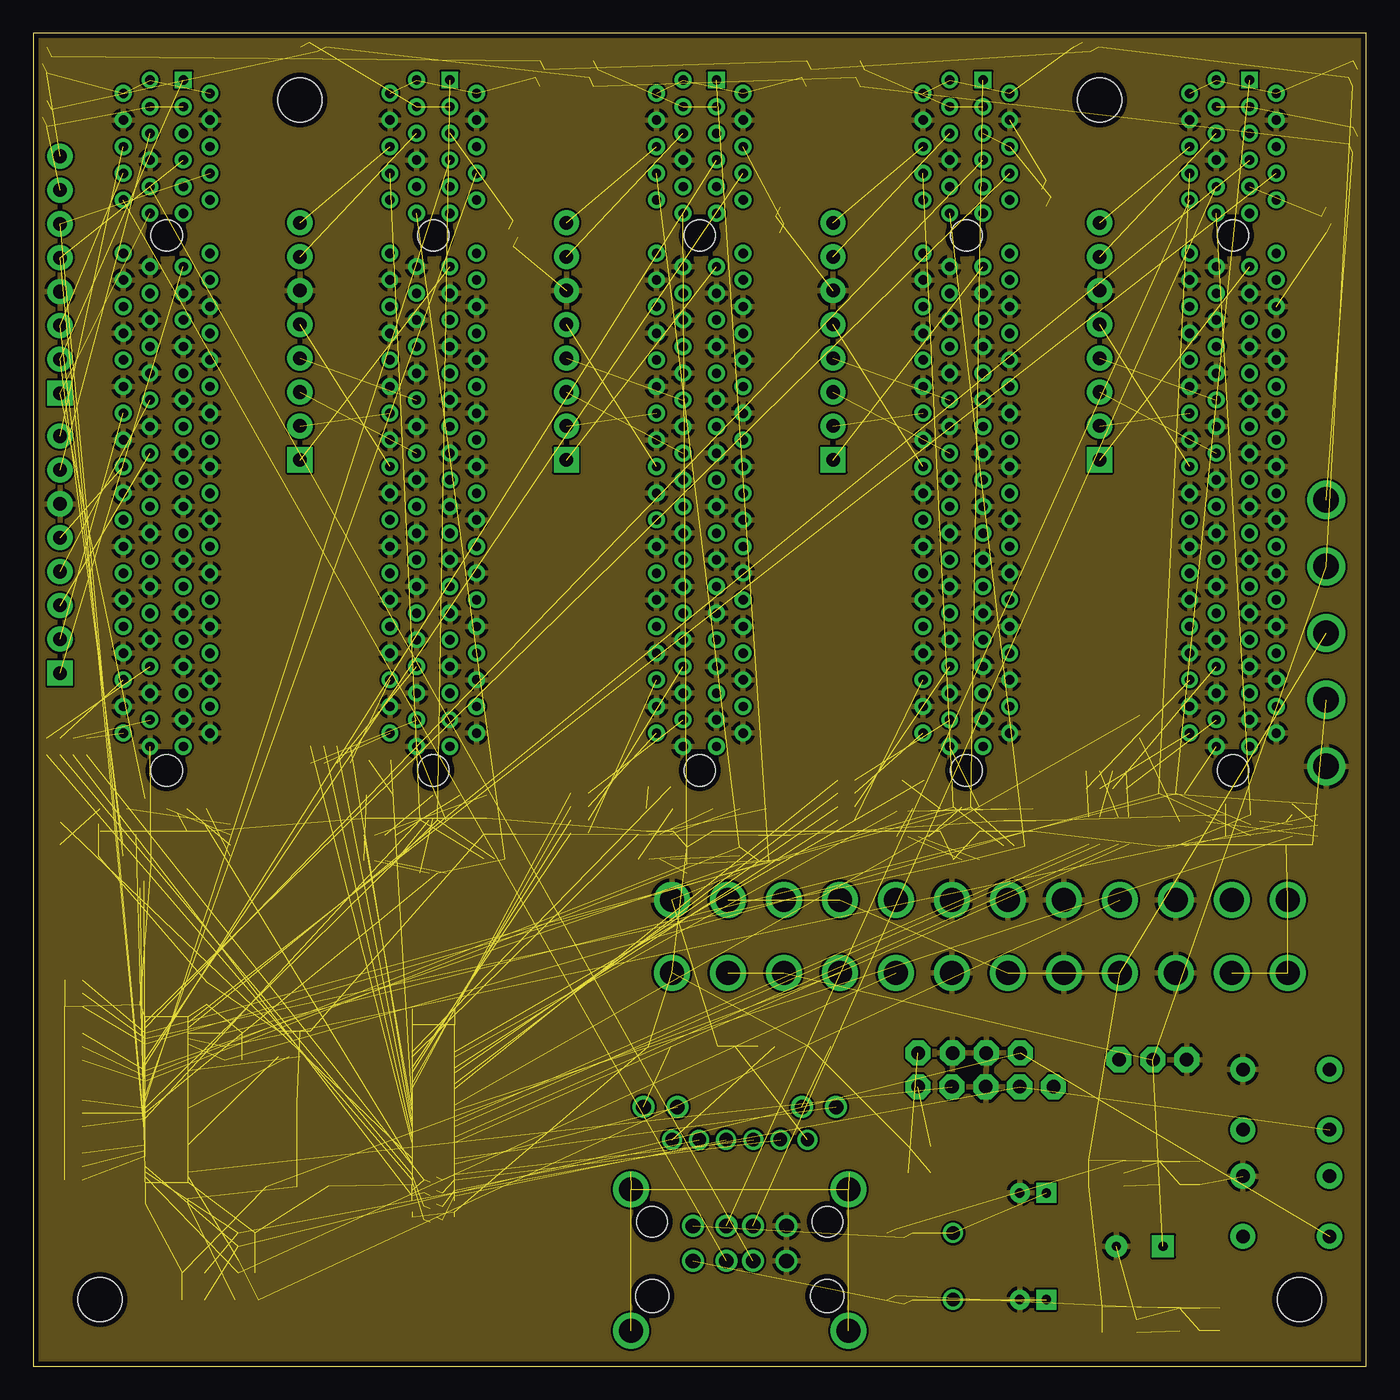
[diagram p6: board, inner layer Route2]
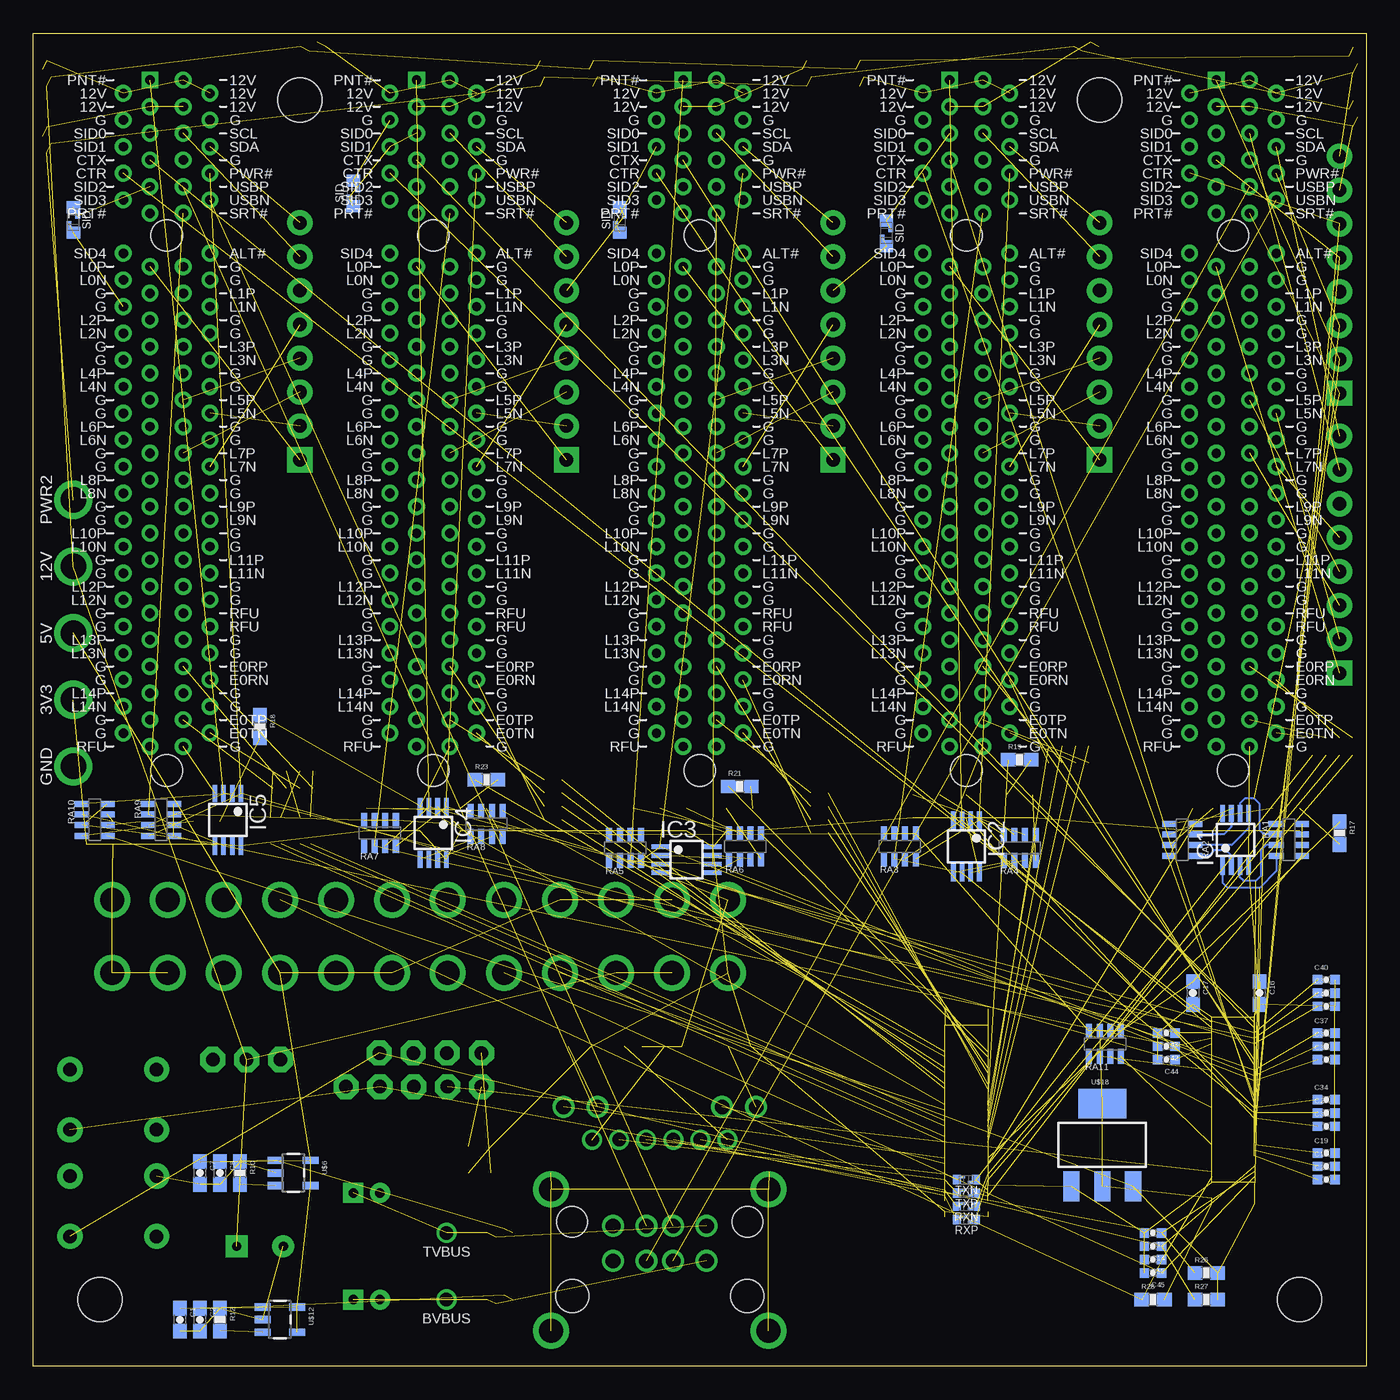
[diagram p7: board, bottom side, seen from below]

Size 100 x 100 mm. Coordinates in mm from the lower left corner, seen from the top.
Outline: 100,100 0,100 0,0 100,0 100,100
Copper layers (1*2*15*16): Top 0.035mm / dielectric 0.2mm / Route2 0.0175mm / dielectric 0.3mm / Route15 0.0175mm / dielectric 0.2mm / Bottom 0.035mm
Design rules "my_SeeedStudio_4layer_DRU_no_angle_20140221": minimum track width 6mil, minimum drill 12mil, track to track 6mil, track to pad 6mil, pad to pad 6mil, via to via 6mil, smd to smd 6mil, copper to edge 15mil, drill to drill 10mil, minimum pad ring 6mil, minimum via ring 6mil, stop-mask expansion 2mil, vias tented up to drill 12mil, thermal gap 10mil

### Footprints (pad centres in the part's own frame; a part is rotated, then mirrored left to right if it is on the bottom)
0603-CAP = smd 1.1 x 1: 1 -0.85,0; 2 0.85,0
CAP-5-2 = drill 0.7 pad 1.5 square: 1 1,0 | drill 0.7 pad 1.5: 2 -1,0
0402-CAP = smd 0.7 x 0.7: 1 -0.65,0; 2 0.65,0
FAN-3PIN = drill 1.016 pad 1.88 octagon: 12V 0,0; GND 2.54,0; TACH -2.54,0
CAP-8-3.5 = drill 0.7 pad 1.651 square: 1 1.75,0 | drill 0.7 pad 1.651: 2 -1.75,0
SRF2012A = smd 0.9 x 0.4: 1 -1,0.4; 2 1,0.4; 3 1,-0.4; 4 -1,-0.4
HOLE_18AWG = drill 1.905: P$1 0,0
HOLE_22AWG = drill 1.016: P 0,0
TSSOP8 = smd 1.3 x 0.35: 1 -1.975,0.975; 2 -1.975,0.325; 3 -1.975,-0.325; 4 -1.975,-0.975; 5 1.975,-0.975; 6 1.975,-0.325; 7 1.975,0.325; 8 1.975,0.975
1X08 = drill 1.016 pad 1.88 square: 1 0,0 | drill 1.016 pad 1.88: 2 2.54,0; 3 5.08,0; 4 7.62,0; 5 10.16,0; 6 12.7,0; 7 15.24,0; 8 17.78,0
0603_LED = smd 0.8 x 1.003: A 0,-0.852; C 0,0.852
0603-RES = smd 1.1 x 1: 1 -0.85,0; 2 0.85,0
0603-ARV = smd 0.45 x 1.1: 1 -1.2,-0.95; 2 -0.4,-0.95; 3 0.4,-0.95; 4 1.2,-0.95; 5 1.2,0.95; 6 0.4,0.95; 7 -0.4,0.95; 8 -1.2,0.95
TACTILE-PTH = drill 1.016 pad 1.88: 1 -3.251,2.261; 2 3.251,2.261; 3 -3.251,-2.261; 4 3.251,-2.261
SB-0603 = smd 0.9 x 1: L1 -0.95,0; R1 0.95,0 | smd 0.4 x 0.35: L2 -0.3,0.325; R2 0.3,-0.325
SB-0402 = smd 0.6 x 0.7: L1 -0.7,0; R1 0.7,0 | smd 0.3 x 0.2: L2 -0.25,0.2; R2 0.25,-0.2
CVN-V1-CONN = drill 0.7 pad 1.27 square: A1 -11.5,1.25 | drill 0.7 pad 1.27: A2 -10.5,3.25; A3 -9.5,1.25; A4 -8.5,3.25; A5 -7.5,1.25; A6 -6.5,3.25; A7 -5.5,1.25; A8 -4.5,3.25; A9 -3.5,1.25; A10 -2.5,3.25; A11 -1.5,1.25; A12 1.5,3.25; A13 2.5,1.25; A14 3.5,3.25; A15 4.5,1.25; A16 5.5,3.25; A17 6.5,1.25; A18 7.5,3.25; A19 8.5,1.25; A20 9.5,3.25; A21 10.5,1.25; A22 11.5,3.25; A23 12.5,1.25; A24 13.5,3.25; A25 14.5,1.25; A26 15.5,3.25; A27 16.5,1.25; A28 17.5,3.25; A29 18.5,1.25; A30 19.5,3.25; A31 20.5,1.25; A32 21.5,3.25; A33 22.5,1.25; A34 23.5,3.25; A35 24.5,1.25; A36 25.5,3.25; A37 26.5,1.25; A38 27.5,3.25; A39 28.5,1.25; A40 29.5,3.25; A41 30.5,1.25; A42 31.5,3.25; A43 32.5,1.25; A44 33.5,3.25; A45 34.5,1.25; A46 35.5,3.25; A47 36.5,1.25; A48 37.5,3.25; A49 38.5,1.25; B1 -11.5,-1.25; B2 -10.5,-3.25; B3 -9.5,-1.25; B4 -8.5,-3.25; B5 -7.5,-1.25; B6 -6.5,-3.25; B7 -5.5,-1.25; B8 -4.5,-3.25; B9 -3.5,-1.25; B10 -2.5,-3.25; B11 -1.5,-1.25; B12 1.5,-3.25; B13 2.5,-1.25; B14 3.5,-3.25; B15 4.5,-1.25; B16 5.5,-3.25; B17 6.5,-1.25; B18 7.5,-3.25; B19 8.5,-1.25; B20 9.5,-3.25; B21 10.5,-1.25; B22 11.5,-3.25; B23 12.5,-1.25; B24 13.5,-3.25; B25 14.5,-1.25; B26 15.5,-3.25; B27 16.5,-1.25; B28 17.5,-3.25; B29 18.5,-1.25; B30 19.5,-3.25; B31 20.5,-1.25; B32 21.5,-3.25; B33 22.5,-1.25; B34 23.5,-3.25; B35 24.5,-1.25; B36 25.5,-3.25; B37 26.5,-1.25; B38 27.5,-3.25; B39 28.5,-1.25; B40 29.5,-3.25; B41 30.5,-1.25; B42 31.5,-3.25; B43 32.5,-1.25; B44 33.5,-3.25; B45 34.5,-1.25; B46 35.5,-3.25; B47 36.5,-1.25; B48 37.5,-3.25; B49 38.5,-1.25 | hole 2.35: 0.15,0; 40.3,0
DF40-RCP-80 = smd 0.2 x 1: 1 -7.8,-1.6; 2 -7.4,-1.6; 3 -7,-1.6; 4 -6.6,-1.6; 5 -6.2,-1.6; 6 -5.8,-1.6; 7 -5.4,-1.6; 8 -5,-1.6; 9 -4.6,-1.6; 10 -4.2,-1.6; 11 -3.8,-1.6; 12 -3.4,-1.6; 13 -3,-1.6; 14 -2.6,-1.6; 15 -2.2,-1.6; 16 -1.8,-1.6; 17 -1.4,-1.6; 18 -1,-1.6; 19 -0.6,-1.6; 20 -0.2,-1.6; 21 0.2,-1.6; 22 0.6,-1.6; 23 1,-1.6; 24 1.4,-1.6; 25 1.8,-1.6; 26 2.2,-1.6; 27 2.6,-1.6; 28 3,-1.6; 29 3.4,-1.6; 30 3.8,-1.6; 31 4.2,-1.6; 32 4.6,-1.6; 33 5,-1.6; 34 5.4,-1.6; 35 5.8,-1.6; 36 6.2,-1.6; 37 6.6,-1.6; 38 7,-1.6; 39 7.4,-1.6; 40 7.8,-1.6; 41 7.8,1.6; 42 7.4,1.6; 43 7,1.6; 44 6.6,1.6; 45 6.2,1.6; 46 5.8,1.6; 47 5.4,1.6; 48 5,1.6; 49 4.6,1.6; 50 4.2,1.6; 51 3.8,1.6; 52 3.4,1.6; 53 3,1.6; 54 2.6,1.6; 55 2.2,1.6; 56 1.8,1.6; 57 1.4,1.6; 58 1,1.6; 59 0.6,1.6; 60 0.2,1.6; 61 -0.2,1.6; 62 -0.6,1.6; 63 -1,1.6; 64 -1.4,1.6; 65 -1.8,1.6; 66 -2.2,1.6; 67 -2.6,1.6; 68 -3,1.6; 69 -3.4,1.6; 70 -3.8,1.6; 71 -4.2,1.6; 72 -4.6,1.6; 73 -5,1.6; 74 -5.4,1.6; 75 -5.8,1.6; 76 -6.2,1.6; 77 -6.6,1.6; 78 -7,1.6; 79 -7.4,1.6; 80 -7.8,1.6
DF40-RCP-90 = smd 0.2 x 1: 1 -8.8,-1.6; 2 -8.4,-1.6; 3 -8,-1.6; 4 -7.6,-1.6; 5 -7.2,-1.6; 6 -6.8,-1.6; 7 -6.4,-1.6; 8 -6,-1.6; 9 -5.6,-1.6; 10 -5.2,-1.6; 11 -4.8,-1.6; 12 -4.4,-1.6; 13 -4,-1.6; 14 -3.6,-1.6; 15 -3.2,-1.6; 16 -2.8,-1.6; 17 -2.4,-1.6; 18 -2,-1.6; 19 -1.6,-1.6; 20 -1.2,-1.6; 21 -0.8,-1.6; 22 -0.4,-1.6; 23 0,-1.6; 24 0.4,-1.6; 25 0.8,-1.6; 26 1.2,-1.6; 27 1.6,-1.6; 28 2,-1.6; 29 2.4,-1.6; 30 2.8,-1.6; 31 3.2,-1.6; 32 3.6,-1.6; 33 4,-1.6; 34 4.4,-1.6; 35 4.8,-1.6; 36 5.2,-1.6; 37 5.6,-1.6; 38 6,-1.6; 39 6.4,-1.6; 40 6.8,-1.6; 41 7.2,-1.6; 42 7.6,-1.6; 43 8,-1.6; 44 8.4,-1.6; 45 8.8,-1.6; 46 8.8,1.6; 47 8.4,1.6; 48 8,1.6; 49 7.6,1.6; 50 7.2,1.6; 51 6.8,1.6; 52 6.4,1.6; 53 6,1.6; 54 5.6,1.6; 55 5.2,1.6; 56 4.8,1.6; 57 4.4,1.6; 58 4,1.6; 59 3.6,1.6; 60 3.2,1.6; 61 2.8,1.6; 62 2.4,1.6; 63 2,1.6; 64 1.6,1.6; 65 1.2,1.6; 66 0.8,1.6; 67 0.4,1.6; 68 0,1.6; 69 -0.4,1.6; 70 -0.8,1.6; 71 -1.2,1.6; 72 -1.6,1.6; 73 -2,1.6; 74 -2.4,1.6; 75 -2.8,1.6; 76 -3.2,1.6; 77 -3.6,1.6; 78 -4,1.6; 79 -4.4,1.6; 80 -4.8,1.6; 81 -5.2,1.6; 82 -5.6,1.6; 83 -6,1.6; 84 -6.4,1.6; 85 -6.8,1.6; 86 -7.2,1.6; 87 -7.6,1.6; 88 -8,1.6; 89 -8.4,1.6; 90 -8.8,1.6
SOT23-5 = smd 0.55 x 1.2: 1 -0.95,-1.3; 2 0,-1.3; 3 0.95,-1.3; 4 0.95,1.3; 5 -0.95,1.3
STAND-OFF = hole 3.302: 0,0
FRONT-PANEL = drill 1.016 pad 1.88 octagon: HDLED+ -5.12,-2.54; HDLED- -2.58,-2.54; NC 5.04,-2.54; PLED+ -5.12,0; PLED- -2.54,0; PWR_1 0,0; PWR_2 2.54,0; RST_1 -0.04,-2.54; RST_2 2.5,-2.54
ATX-24-VERT-NOPEGS = drill 1.8: 1 23.1,-5.5; 2 18.9,-5.5; 3 14.7,-5.5; 4 10.5,-5.5; 5 6.3,-5.5; 6 2.1,-5.5; 7 -2.1,-5.5; 8 -6.3,-5.5; 9 -10.5,-5.5; 10 -14.7,-5.5; 11 -18.9,-5.5; 12 -23.1,-5.5; 13 23.1,0; 14 18.9,0; 15 14.7,0; 16 10.5,0; 17 6.3,0; 18 2.1,0; 19 -2.1,0; 20 -6.3,0; 21 -10.5,0; 22 -14.7,0; 23 -18.9,0; 24 -23.1,0
MAGJACK-DUALUSB = drill 1.1: BD+ 1.005,-9.1; BD- -1.005,-9.1; BGND 3.505,-9.1; BVBUS -3.505,-9.1; R7 7.225,2.44; R8 4.685,2.44; R9 -4.685,2.44; R10 -7.225,2.44; TD+ 1.005,-6.48; TD- -1.005,-6.48; TGND 3.505,-6.48; TVBUS -3.505,-6.48 | drill 1: R1 5.075,0; R2 3.045,0; R3 1.015,0; R4 -1.015,0; R5 -3.045,0; R6 -5.075,0 | drill 1.8 pad 2.4: S1 -8.165,-3.73; S2 8.165,-3.73; S3 8.165,-14.35; S4 -8.165,-14.35 | smd 0.5 x 0.5: S7 -8.2,-2.4; S8 8.2,-2.5 | hole 2.3: -6.565,-6.15; 6.565,-6.15 | hole 2.5: -6.565,-11.74; 6.565,-11.74
SOT223 = smd 1.219 x 2.235: 1 -2.311,-3.099; 2 0,-3.099; 3 2.311,-3.099 | smd 3.6 x 2.2: 4 0,3.099

### Placement (x,y rotation side)
C1  89,3.5 270 bottom
C2  87.5,3.5 270 bottom
C3  75,5 0 top
C4  55,24 0 top
C5  52,24 0 top
C6  20.8,45.9 90 top
C7  87.5,14.5 270 bottom
C8  86,14.5 270 bottom
C9  21.8,45.9 90 top
C10  22.8,45.9 90 top
C11  23.8,45.9 90 top
C12  84,23 0 top
C13  16,10 180 bottom
C14  16,9 180 bottom
C15  16,8 180 bottom
C16  8,28 270 bottom
C17  13,28 270 bottom
C18  3,15 0 bottom
C19  3,16 0 bottom
C22  83,9 0 top
C23  61,44 0 top
C24  61,43 0 top
C25  61,42 0 top
C26  61,41 0 top
C27  3,14 0 bottom
C28  75,13 0 top
C29  3,19 0 bottom
C30  41,43 0 top
C31  41,42 0 top
C32  41,41 0 top
C33  41,40 0 top
C34  3,20 0 bottom
C35  3,18 0 bottom
C36  3,24 0 bottom
C37  3,25 0 bottom
C38  3,23 0 bottom
C39  3,28 0 bottom
C40  3,29 0 bottom
C41  3,27 0 bottom
C42  15,24 180 bottom
C43  15,25 180 bottom
C44  15,23 180 bottom
C45  16,7 180 bottom
C46  82,44 270 top
C47  80,44 270 top
C48  81,44 270 top
C49  79,44 270 top
C50  3,46.5 270 top
C51  4,46.5 270 top
C52  1,46.5 270 top
C53  2,46.5 270 top
CH1  81.8,40.2 270 top
CH2  79.6,40.2 270 top
CONN1  97,65 90 top
CONN2  97,45 90 top
CONN3  97,60 90 top
CONN4  97,50 90 top
CONN5  69,10 0 top
CONN6  69,5 0 top
CONN7  97,55 90 top
IC1  9.8,39.5 90 bottom
IC2  30,39 270 bottom
IC3  51,38 0 bottom
IC4  70,40 270 bottom
IC5  85.4,41 270 bottom
JP1  2,52 90 top
JP2  20,68 90 top
JP3  40,68 90 top
JP4  60,68 90 top
JP5  80,68 90 top
JP6  2,73 90 top
LED0_1  5,41 0 top
LED0_2  7,41 0 top
LED1_1  27,42 0 top
LED1_2  25,42 0 top
LED2_1  46,41 0 top
LED2_2  48,41 0 top
LED3_1  68,41 0 top
LED3_2  66,41 0 top
LED4_1  86,40 0 top
LED4_2  88,40 0 top
LPRSNT_0  11.5,41 0 top
LPRSNT_1  30,42 0 top
LPRSNT_2  51,41 0 top
LPRSNT_3  71,41 0 top
LPRSNT_4  94,40 0 top
LPWR_ON_0  10,41 0 top
LPWR_ON_1  34,42 0 top
LPWR_ON_2  55,41 0 top
LPWR_ON_3  75,41 0 top
LPWR_ON_4  92,40 0 top
LRST_0  13,41 0 top
LRST_1  32,42 0 top
LRST_2  53,41 0 top
LRST_3  73,41 0 top
LRST_4  96,40 0 top
R10  84.5,14.5 270 bottom
R12  86,3.5 270 bottom
R15  59,24 0 top
R16  47,24 0 top
R17  2,40 270 bottom
R18  83,48 270 bottom
R19  26,45.5 0 bottom
R21  47,43.5 0 bottom
R23  66,44 0 bottom
R24  66.5,14.5 0 top
R25  66.5,16.5 0 top
R26  12,7 0 bottom
R27  12,5 0 bottom
R28  16,5 0 bottom
RA1  5.8,39.5 270 bottom
RA2  13.8,39.5 90 bottom
RA3  35,39 0 bottom
RA4  26,38.9 0 bottom
RA5  55.6,38.9 0 bottom
RA6  46.6,39 0 bottom
RA7  74,40 0 bottom
RA8  66,40.7 0 bottom
RA9  90.4,41 270 bottom
RA10  95.4,41 270 bottom
RA11  19.6,24.2 0 bottom
S1  94,20 0 top
S2  94,12 0 top
SB1  1,98 270 top
SB2  1,94 270 top
SB3  38,97 270 top
SB4  21,99 180 top
SB5  58,97 270 top
SB6  42,97 90 top
SB7  79,99 180 top
SB8  62,97 90 top
SB9  36,85 270 bottom
SB10  56,86 90 bottom
SB11  76,88 90 bottom
SB12  65,10 0 top
SB13  65,5 0 top
SB14  99,97 90 top
SB15  99,92 90 top
SB16  97,86 270 bottom
SB17  30,11 180 bottom
SB18  30,12 180 bottom
SB19  30,13 180 bottom
SB20  30,14 180 bottom
SOCKET1  10,85 270 top
SOCKET2  30,85 270 top
SOCKET3  50,85 270 top
SOCKET4  70,85 270 top
SOCKET5  90,85 270 top
U$2  10,20 90 top
U$3  30,20 90 top
U$6  80.5,14.5 270 bottom
U$7  [STAND-OFF]  80,95 180 top
U$8  [STAND-OFF]  20,95 180 top
U$9  [STAND-OFF]  5,5 180 top
U$10  [STAND-OFF]  95,5 180 top
U$11  71.5,23.5 0 top
U$12  81.5,3.5 270 bottom
U$13  71,35 0 top
U$15  53,17 0 top
U$18  19.8,16.6 0 bottom

### Tracks (layer width: path | path; a pad name or v marks a point on that pad's centre or on a via)
3.3V  (42 unrouted)
3.3VSB  (29 unrouted)
5V  (11 unrouted)
5VSB  (7 unrouted)
12V  (14 unrouted)
12V_0  (5 unrouted)
12V_1  (4 unrouted)
12V_2  (4 unrouted)
12V_3  (4 unrouted)
12V_4  (4 unrouted)
!PS_ON  (3 unrouted)
B_VBUS  (4 unrouted)
COM_RX_0  (2 unrouted)
COM_RX_1  (1 unrouted)
COM_RX_2  (1 unrouted)
COM_RX_3  (1 unrouted)
COM_RX_4  (1 unrouted)
COM_TX_0  (2 unrouted)
COM_TX_1  (1 unrouted)
COM_TX_2  (1 unrouted)
COM_TX_3  (1 unrouted)
COM_TX_4  (1 unrouted)
E0_RXN  (1 unrouted)
E0_RXN_C  (3 unrouted)
E0_RXP  (1 unrouted)
E0_RXP_C  (3 unrouted)
E0_SHLD  (5 unrouted)
E0_TXN  (1 unrouted)
E0_TXN_C  (3 unrouted)
E0_TXP  (1 unrouted)
E0_TXP_C  (3 unrouted)
E1_RXN  (1 unrouted)
E1_RXP  (1 unrouted)
E1_TXN  (1 unrouted)
E1_TXP  (1 unrouted)
E2_RXN  (1 unrouted)
E2_RXP  (1 unrouted)
E2_TXN  (1 unrouted)
E2_TXP  (1 unrouted)
E3_RXN  (1 unrouted)
E3_RXP  (1 unrouted)
E3_TXN  (1 unrouted)
E3_TXP  (1 unrouted)
E4_RXN  (1 unrouted)
E4_RXP  (1 unrouted)
E4_TXN  (1 unrouted)
E4_TXP  (1 unrouted)
EX_RXN  (3 unrouted)
EX_RXP  (3 unrouted)
EX_TXN  (3 unrouted)
EX_TXP  (3 unrouted)
GND  (79 unrouted)
  pour Route2: -5,105 105,105 105,-5 -5,-5
HD_LED  (1 unrouted)
HOST_VBUS_U  (3 unrouted)
HOST_VBUS_U1  (3 unrouted)
I2C_SCL_0  (1 unrouted)
I2C_SCL_1  (1 unrouted)
I2C_SCL_2  (1 unrouted)
I2C_SCL_3  (1 unrouted)
I2C_SCL_4  (1 unrouted)
I2C_SDA_0  (1 unrouted)
I2C_SDA_1  (1 unrouted)
I2C_SDA_2  (1 unrouted)
I2C_SDA_3  (1 unrouted)
I2C_SDA_4  (1 unrouted)
LED0_1  (1 unrouted)
LED0_2  (1 unrouted)
LED1_1  (1 unrouted)
LED1_2  (1 unrouted)
LED2_1  (1 unrouted)
LED2_2  (1 unrouted)
LED3_1  (1 unrouted)
LED3_2  (1 unrouted)
LED4_1  (1 unrouted)
LED4_2  (1 unrouted)
LEDX_1  (1 unrouted)
LEDX_2  (1 unrouted)
N$1  (2 unrouted)
N$2  (3 unrouted)
N$3  (2 unrouted)
N$4  (1 unrouted)
N$5  (1 unrouted)
N$6  (1 unrouted)
N$7  (1 unrouted)
N$8  (1 unrouted)
N$9
  Bottom 0.152: IC1.7 10.12,40.48 10.7,39.9 RA2.3
N$10
  Bottom 0.152: IC1.5 8.82,40.38 10.1,39.1 RA2.2
N$11
  Bottom 0.152: IC1.2 10.12,38.33 10.5,38.7 11.4,38.7 11.8,38.3 RA2.1
N$12  (1 unrouted)
N$13  (1 unrouted)
N$14  (1 unrouted)
N$15  (1 unrouted)
N$16  (1 unrouted)
N$17  (1 unrouted)
N$18  (1 unrouted)
N$19  (1 unrouted)
N$20  (1 unrouted)
N$21  (1 unrouted)
N$22  (1 unrouted)
N$23  (1 unrouted)
N$24  (1 unrouted)
N$25  (1 unrouted)
N$26  (1 unrouted)
N$27  (1 unrouted)
N$28  (1 unrouted)
N$29  (1 unrouted)
N$30  (1 unrouted)
N$31  (1 unrouted)
N$32  (1 unrouted)
N$33  (1 unrouted)
N$34  (1 unrouted)
N$35  (1 unrouted)
N$36  (2 unrouted)
N$37  (1 unrouted)
N$38  (1 unrouted)
N$40  (1 unrouted)
N$41  (1 unrouted)
N$42  (1 unrouted)
N$43  (1 unrouted)
N$44  (1 unrouted)
N$45  (1 unrouted)
N$46  (1 unrouted)
N$47  (1 unrouted)
N$48  (1 unrouted)
N$49  (1 unrouted)
N$50  (1 unrouted)
N$51  (1 unrouted)
N$52  (1 unrouted)
N$53  (1 unrouted)
N$54  (1 unrouted)
N$55  (1 unrouted)
N$56  (1 unrouted)
N$57  (1 unrouted)
N$58  (1 unrouted)
N$59  (1 unrouted)
N$60  (1 unrouted)
N$61  (1 unrouted)
N$62  (1 unrouted)
N$63  (1 unrouted)
N$64  (1 unrouted)
N$65  (1 unrouted)
N$66  (1 unrouted)
N$67  (1 unrouted)
N$68  (1 unrouted)
N$69  (1 unrouted)
N$70  (1 unrouted)
N$71  (1 unrouted)
N$73  (1 unrouted)
N$96  (1 unrouted)
PRSNT#_0  (4 unrouted)
  Bottom 0.152: RA1.3 7.5,39.1 7.9,38.7 7.9,36.8 8.3,36.4 9.2,36.4 9.47,36.67 IC1.3
PRSNT#_1  (4 unrouted)
PRSNT#_2  (4 unrouted)
PRSNT#_3  (4 unrouted)
PRSNT#_4  (4 unrouted)
PRSNT#_5  (1 unrouted)
PRSNT#_6  (1 unrouted)
PRSNT#_7  (1 unrouted)
PWR2  (10 unrouted)
PWR2_0  (4 unrouted)
PWR2_1  (3 unrouted)
PWR2_2  (3 unrouted)
PWR2_3  (3 unrouted)
PWR2_4  (3 unrouted)
PWR_BUT  (4 unrouted)
PWR_OK  (2 unrouted)
PWR_ON#_0  (4 unrouted)
  Bottom 0.152: RA1.4 6.75,37.15 8,35.9 10.4,35.9 10.78,36.27 IC1.1
PWR_ON#_1  (4 unrouted)
PWR_ON#_2  (4 unrouted)
PWR_ON#_3  (4 unrouted)
PWR_ON#_4  (4 unrouted)
RESET_BUT  (4 unrouted)
SPI_CLK_0  (1 unrouted)
SPI_CLK_1  (1 unrouted)
SPI_CLK_2  (1 unrouted)
SPI_CLK_3  (1 unrouted)
SPI_CLK_4  (1 unrouted)
SPI_CS_0  (1 unrouted)
SPI_CS_1  (1 unrouted)
SPI_CS_2  (1 unrouted)
SPI_CS_3  (1 unrouted)
SPI_CS_4  (1 unrouted)
SPI_MISO_0  (1 unrouted)
SPI_MISO_1  (1 unrouted)
SPI_MISO_2  (1 unrouted)
SPI_MISO_3  (1 unrouted)
SPI_MISO_4  (1 unrouted)
SPI_MOSI_0  (1 unrouted)
SPI_MOSI_1  (1 unrouted)
SPI_MOSI_2  (1 unrouted)
SPI_MOSI_3  (1 unrouted)
SPI_MOSI_4  (1 unrouted)
SYS_RESET#_0  (4 unrouted)
  Bottom 0.152: RA1.2 7.7,39.9 8,40.2 8,42.2 8.4,42.6 9.1,42.6 9.47,42.23 IC1.6
SYS_RESET#_1  (4 unrouted)
SYS_RESET#_2  (4 unrouted)
SYS_RESET#_3  (4 unrouted)
SYS_RESET#_4  (4 unrouted)
T_VBUS  (4 unrouted)
UBOOT_0  (1 unrouted)
UBOOT_1  (1 unrouted)
UBOOT_2  (1 unrouted)
UBOOT_3  (1 unrouted)
UBOOT_4  (1 unrouted)
USB_N_0  (1 unrouted)
USB_N_4  (1 unrouted)
USB_P_0  (1 unrouted)
USB_P_4  (1 unrouted)

### Text on the board
tPlace: 12V | P2 | RX | TX | GND | PWR | PNT | RST | SDA | SCL | GND | CS | MOSI | CLK | MISO | UBT